# EAGLE design BMSMaster (EAGLE 6.6.0)

## Sheet 1 of 2
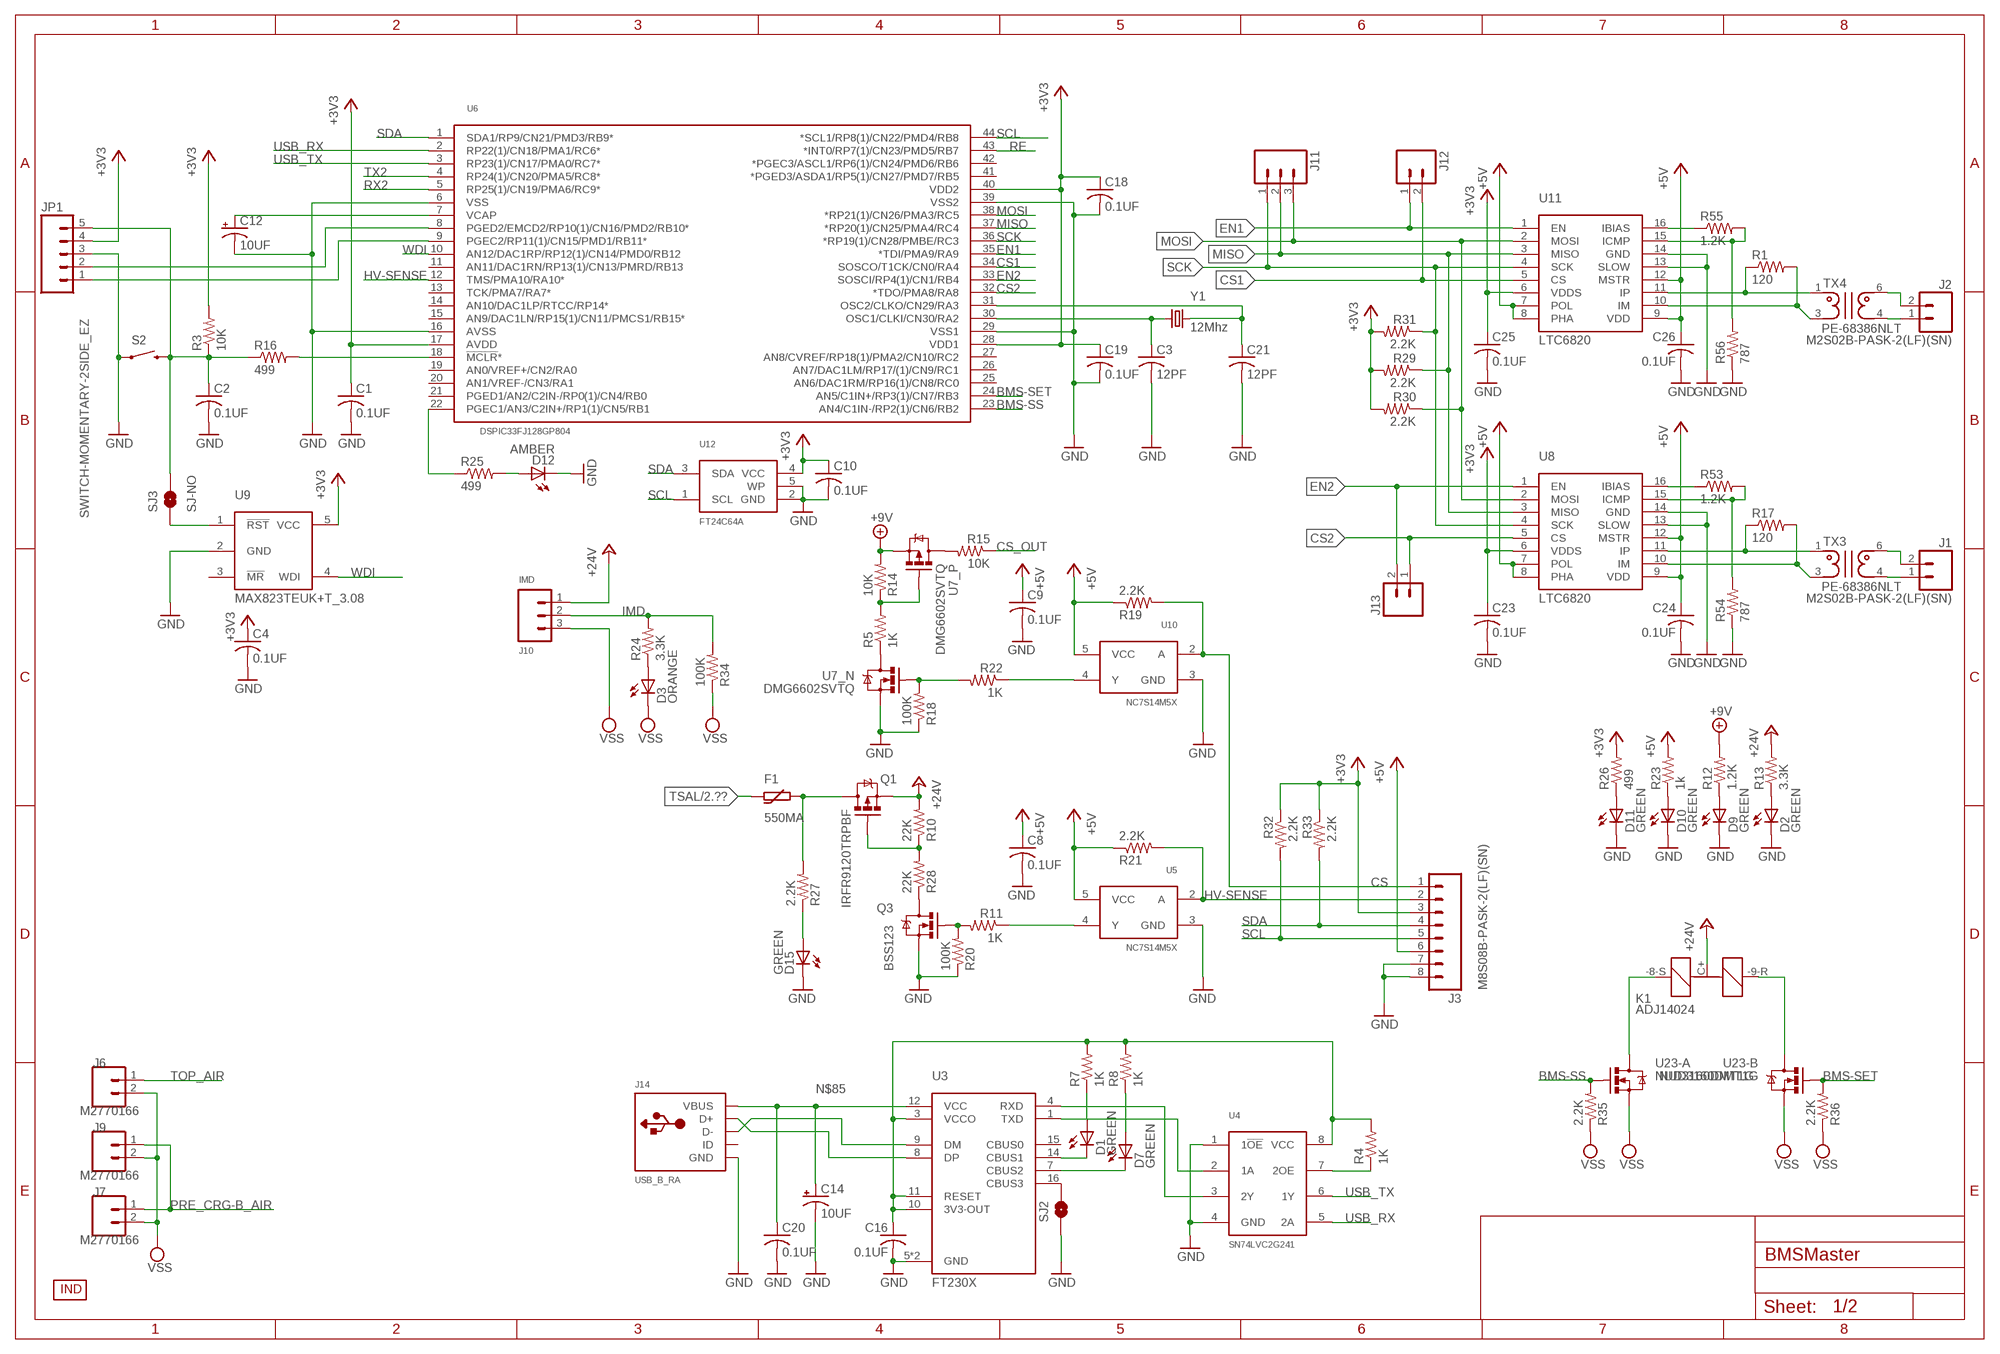
[diagram p0: schematic, sheet 1]

### Parts
C1  0.1UF  CAP_0.1UF_50V_0805  [0805]
C2  0.1UF  CAP_0.1UF_50V_0805  [0805]
C3  12PF  CAP_12PF_50V_0805  [0805]
C4  0.1UF  CAP_0.1UF_50V_0805  [0805]
C8  0.1UF  CAP_0.1UF_50V_0805  [0805]
C9  0.1UF  CAP_0.1UF_50V_0805  [0805]
C10  0.1UF  CAP_0.1UF_50V_0805  [0805]
C12  10UF  CAP-POL_10UF_16V  [EIA3216-16V]
C14  10UF  CAP-POL_10UF_16V  [EIA3216-16V]
C16  0.1UF  CAP_0.1UF_50V_0805  [0805]
C18  0.1UF  CAP_0.1UF_50V_0805  [0805]
C19  0.1UF  CAP_0.1UF_50V_0805  [0805]
C20  0.1UF  CAP_0.1UF_50V_0805  [0805]
C21  12PF  CAP_12PF_50V_0805  [0805]
C23  0.1UF  CAP_0.1UF_50V_0805  [0805]
C24  0.1UF  CAP_0.1UF_50V_0805  [0805]
C25  0.1UF  CAP_0.1UF_50V_0805  [0805]
C26  0.1UF  CAP_0.1UF_50V_0805  [0805]
D1  GREEN  LED_GREEN  [CHIP_LED0805]
D2  GREEN  LED_GREEN  [CHIP_LED0805]
D3  ORANGE  LED_ORANGE  [CHIP_LED0805]
D7  GREEN  LED_GREEN  [CHIP_LED0805]
D9  GREEN  LED_GREEN  [CHIP_LED0805]
D10  GREEN  LED_GREEN  [CHIP_LED0805]
D11  GREEN  LED_GREEN  [CHIP_LED0805]
D12  AMBER  LED_AMBER  [CHIP_LED0805]
D15  GREEN  LED_GREEN  [CHIP_LED0805]
F1  550MA  PTC_550MA_60V  [2018]
J1  M2S02B-PASK-2(LF)(SN)  [S02B-PASK-2(LF)(SN)]
J2  M2S02B-PASK-2(LF)(SN)  [S02B-PASK-2(LF)(SN)]
J3  M8S08B-PASK-2(LF)(SN)  [S08B-PASK-2(LF)(SN)]
J6  M2770166  [1-770166-0]
J7  M2770166  [1-770166-0]
J9  M2770166  [1-770166-0]
J10  IMD  M3M1X3  [MOLEX-1X3]
J11  M03LOCK_LONGPADS  [1X03_LOCK_LONGPADS]
J12  M02LOCK_LONGPADS  [1X02_LOCK_LONGPADS]
J13  M02LOCK_LONGPADS  [1X02_LOCK_LONGPADS]
J14  USB_B_RA  [USB-B1HSW6]
JP1  M05LOCK_LONGPADS  [1X05_LOCK_LONGPADS]
K1  ADJ14024  [ADJ14024]
Q1  IRFR9120TRPBF  MOS-P_IRFR9120TRPBF  [DPAK]
Q3  BSS123  MOS-N_BSS123  [SOT23]
R1  120  RES_120_1%_0805  [0805]
R3  10K  RES_10K_1%_0805  [0805]
R4  1K  RES_1K_1%_0805  [0805]
R5  1K  RES_1K_1%_0805  [0805]
R7  1K  RES_1K_1%_0805  [0805]
R8  1K  RES_1K_1%_0805  [0805]
R10  22K  RES_22K_1%_0805  [0805]
R11  1K  RES_1K_1%_0805  [0805]
R12  1.2K  RES_1.2K_1%_0805  [0805]
R13  3.3K  RES_3.3K_1%_0805  [0805]
R14  10K  RES_10K_1%_0805  [0805]
R15  10K  RES_10K_1%_0805  [0805]
R16  499  RES_499_1%_0805  [0805]
R17  120  RES_120_1%_0805  [0805]
R18  100K  RES_100K_1%_0805  [0805]
R19  2.2K  RES_2.2K_1%_0805  [0805]
R20  100K  RES_100K_1%_0805  [0805]
R21  2.2K  RES_2.2K_1%_0805  [0805]
R22  1K  RES_1K_1%_0805  [0805]
R23  1k  RES_1K_1%_0805  [0805]
R24  3.3K  RES_3.3K_1%_0805  [0805]
R25  499  RES_499_1%_0805  [0805]
R26  499  RES_499_1%_0805  [0805]
R27  2.2K  RES_2.2K_1%_0805  [0805]
R28  22K  RES_22K_1%_0805  [0805]
R29  2.2K  RES_2.2K_1%_0805  [0805]
R30  2.2K  RES_2.2K_1%_0805  [0805]
R31  2.2K  RES_2.2K_1%_0805  [0805]
R32  2.2K  RES_2.2K_1%_0805  [0805]
R33  2.2K  RES_2.2K_1%_0805  [0805]
R34  100K  RES_100K_1%_0805  [0805]
R35  2.2K  RES_2.2K_1%_0805  [0805]
R36  2.2K  RES_2.2K_1%_0805  [0805]
R53  1.2K  RES_1.2K_1%_0805  [0805]
R54  787  RES_787_1%  [0805]
R55  1.2K  RES_1.2K_1%_0805  [0805]
R56  787  RES_787_1%  [0805]
S2  SWITCH-MOMENTARY-2SIDE_EZ  [TACTILE-PTH-SIDEEZ]
SJ2  JUMPER-PAD-2-NOYES_SILK  [PAD-JUMPER-2-NO_YES_SILK]
SJ3  SJ-NO  SOLDERJUMPERNO  [SJ_2S-NO]
TX3  PE-68386NLT  [PE-68386NLT]
TX4  PE-68386NLT  [PE-68386NLT]
U3  FT230X  [SSOP-16]
U4  SN74LVC2G241  [VFSOP-8]
U5  NC7S14M5X  [SOT23-5]
U6  DSPIC33FJ128GP804  [TQFP-44]
U7  DMG6602SVTQ  [SOT23-6]
U8  LTC6820  [MSOP-16]
U9  MAX823TEUK+T_3.08  [SOT23-5]
U10  NC7S14M5X  [SOT23-5]
U11  LTC6820  [MSOP-16]
U12  FT24C64A  [SOT23-5]
U23  NUD3160DMT1G  [SC74-6]
U$1  INDPK1  [PICKIT-PIN-1]
Y1  12Mhz  CRYSTAL5X3  [CRYSTAL-SMD-5X3]

### Nets
3V: C16.1(+) R4.2 R7.2 R8.2 U3.3(VCCO) U3.10(3V3-OUT) U3.11(RESET) U4.8(VCC)
+3V3: C1.1(+) C4.1(+) C10.1(+) C18.1(+) C19.1(+) C23.1(+) C25.1(+) J3.3 JP1.4 R3.2 R26.2 R29.2 R30.2 R31.2 R32.1 R33.1 U6.17(AVDD) U6.28(VDD1) U6.40(VDD2) U8.6(VDDS) U9.5(VCC) U11.6(VDDS) U12.4(VCC) ; also sheet 2
+5V: C8.1(+) C9.1(+) C24.1(+) C26.1(+) J3.6 R19.1 R21.1 R23.2 U5.5(VCC) U8.7(POL) U8.8(PHA) U8.9(VDD) U8.12(MSTR) U10.5(VCC) U11.7(POL) U11.8(PHA) U11.9(VDD) U11.12(MSTR) ; also sheet 2
+9V: R12.2 R14.2 U7.2(_P:S) ; also sheet 2
+24V: J10.1 K1.C+(-) Q1.3(S) R10.2 R13.2 ; also sheet 2
BMS-SET: R36.2 U6.24(AN5/C1IN+/RP3(1)/CN7/RB3) U23.5(-B:G)
BMS-SS: R35.2 U6.23(AN4/C1IN-/RP2(1)/CN6/RB2) U23.2(-A:G)
CS: J3.1 R19.2 U10.2(A)
CS1: J12.2 U6.34(SOSCO/T1CK/CN0/RA4) U11.5(CS)
CS2: J13.1 U6.32(*TDO/PMA8/RA8) U8.5(CS)
CS_OUT: R15.1 ; also sheet 2
EN1: J12.1 U6.35(*TDI/PMA9/RA9) U11.1(EN)
EN2: J13.2 U6.33(SOSCI/RP4(1)/CN1/RB4) U8.1(EN)
GND: C1.2(-) C2.2(-) C3.2(-) C4.2(-) C8.2(-) C9.2(-) C10.2(-) C12.C(-) C14.C(-) C16.2(-) C18.2(-) C19.2(-) C20.2(-) C21.2(-) C23.2(-) C24.2(-) C25.2(-) C26.2(-) D2.C D9.C D10.C D11.C D12.C D15.C J3.7 J3.8 J14.4(GND) JP1.3 Q3.2(S) R18.1 R20.1 R54.1 R56.1 S2.1 SJ2.1 U3.5(GND) U3.13(GND) U4.1(1!OE) U4.4(GND) U5.3(GND) U6.6(VSS) U6.16(AVSS) U6.29(VSS1) U6.39(VSS2) U7.5(_N:S) U8.13(SLOW) U8.14(GND) U9.2(GND) U10.3(GND) U11.13(SLOW) U11.14(GND) U12.2(GND) U12.5(WP) ; also sheet 2
HV-SENSE: J3.2 R21.2 U5.2(A) U6.12(TMS/PMA10/RA10*)
IMD: J10.2 R24.2 R34.2 ; also sheet 2
MISO: J11.2 R29.1 U6.37(*RP20(1)/CN25/PMA4/RC4) U8.3(MISO) U11.3(MISO)
MOSI: J11.3 R30.1 U6.38(*RP21(1)/CN26/PMA3/RC5) U8.2(MOSI) U11.2(MOSI)
N$1: D12.A R25.2
N$2: C21.1(+) U6.31(OSC2/CLKO/CN29/RA3) Y1.3
N$4: C3.1(+) U6.30(OSC1/CLKI/CN30/RA2) Y1.1
N$5: SJ3.1 U9.1(!RST)
N$6: D7.A R8.1
N$7: D9.A R12.1
N$8: D7.C U3.7(CBUS2)
N$9: D10.A R23.1
N$10: D1.C U3.14(CBUS1)
N$11: Q1.1(G) R10.1 R28.2
N$12: D15.A R27.1
N$13: D11.A R26.1
N$14: U3.4(RXD) U4.3(2Y)
N$15: U3.1(TXD) U4.2(1A)
N$16: J14.2(D-) U3.9(DM)
N$17: K1.-8-S(+1) U23.6(-A:D)
N$18: J14.3(D+) U3.8(DP)
N$19: R11.1 U5.4(Y)
N$20: D1.A R7.1
N$25: R53.1 U8.16(IBIAS)
N$26: R53.2 R54.2 U8.15(ICMP)
N$27: C12.A(+) U6.7(VCAP)
N$28: R55.1 U11.16(IBIAS)
N$29: R55.2 R56.2 U11.15(ICMP)
N$30: D2.A R13.1
N$33: J1.2 TX3.6
N$34: J1.1 TX3.4
N$35: R17.1 TX3.1 U8.11(IP)
N$36: R17.2 TX3.3 U8.10(IM)
N$37: R1.1 TX4.1 U11.11(IP)
N$38: R1.2 TX4.3 U11.10(IM)
N$39: R5.2 R14.1 U7.3(_P:G)
N$40: R5.1 U7.6(_N:D)
N$41: R22.1 U10.4(Y)
N$42: D3.A R24.1
N$43: SJ2.2 U3.16(CBUS3)
N$44: R25.1 U6.22(PGEC1/AN3/C2IN+/RP1(1)/CN5/RB1)
N$45: C2.1(+) JP1.5 R3.1 R16.1 S2.2 SJ3.2
N$46: R16.2 U6.18(!MCLR!*)
N$47: JP1.2 U6.8(PGED2/EMCD2/RP10(1)/CN16/PMD2/RB10*)
N$48: JP1.1 U6.9(PGEC2/RP11(1)/CN15/PMD1/RB11*)
N$49: R15.2 U7.4(_P:D)
N$50: Q3.3(D) R28.1
N$51: F1.2 Q1.2(D) R27.2
N$53: J2.2 TX4.6
N$54: K1.-9-R(+2) U23.3(-B:D)
N$55: J2.1 TX4.4
N$69: R4.1 U4.7(2OE)
N$85: C14.A(+) C20.1(+) J14.1(VBUS) U3.12(VCC)
PRE_CRG-B_AIR: J7.1 J9.1 ; also sheet 2
RE: U6.43(*INT0/RP7(1)/CN23/PMD5/RB7) ; also sheet 2
RX2: U6.5(RP25(1)/CN19/PMA6/RC9*) ; also sheet 2
SCK: J11.1 R31.1 U6.36(*RP19(1)/CN28/PMBE/RC3) U8.4(SCK) U11.4(SCK)
SCL: J3.5 R32.2 U6.44(*SCL1/RP8(1)/CN22/PMD4/RB8) U12.1(SCL)
SDA: J3.4 R33.2 U6.1(SDA1/RP9/CN21/PMD3/RB9*) U12.3(SDA)
TOP_AIR: J6.1 ; also sheet 2
TSAL: F1.1 ; also sheet 2
TSAL_EN: Q3.1(G) R11.2 R20.2
TSAL_EN1: R18.2 R22.2 U7.1(_N:G)
TX2: U6.4(RP24(1)/CN20/PMA5/RC8*) ; also sheet 2
USB_RX: U4.5(2A) U6.2(RP22(1)/CN18/PMA1/RC6*)
USB_TX: U4.6(1Y) U6.3(RP23(1)/CN17/PMA0/RC7*)
VSS: D3.C J6.2 J7.2 J9.2 J10.3 R34.1 R35.1 R36.1 U23.1(-A:S) U23.4(-B:S) ; also sheet 2
WDI: U6.10(AN12/DAC1RP/RP12(1)/CN14/PMD0/RB12) U9.4(WDI)
Unconnected: J14.S1(ID) K1.C K1.NC K1.NO U3.15(CBUS0) U6.11(AN11/DAC1RN/RP13(1)/CN13/PMRD/RB13) U6.13(TCK/PMA7/RA7*) U6.14(AN10/DAC1LP/RTCC/RP14*) U6.15(AN9/DAC1LN/RP15(1)/CN11/PMCS1/RB15*) U6.19(AN0/VREF+/CN2/RA0) U6.20(AN1/VREF-/CN3/RA1) U6.21(PGED1/AN2/C2IN-/RP0(1)/CN4/RB0) U6.25(AN6/DAC1RM/RP16(1)/CN8/RC0) U6.26(AN7/DAC1LM/RP17/(1)/CN9/RC1) U6.27(AN8/CVREF/RP18(1)/PMA2/CN10/RC2) U6.41(*PGED3/ASDA1/RP5(1)/CN27/PMD7/RB5) U6.42(*PGEC3/ASCL1/RP6(1)/CN24/PMD6/RB6) U9.3(!MR)

## Sheet 2 of 2
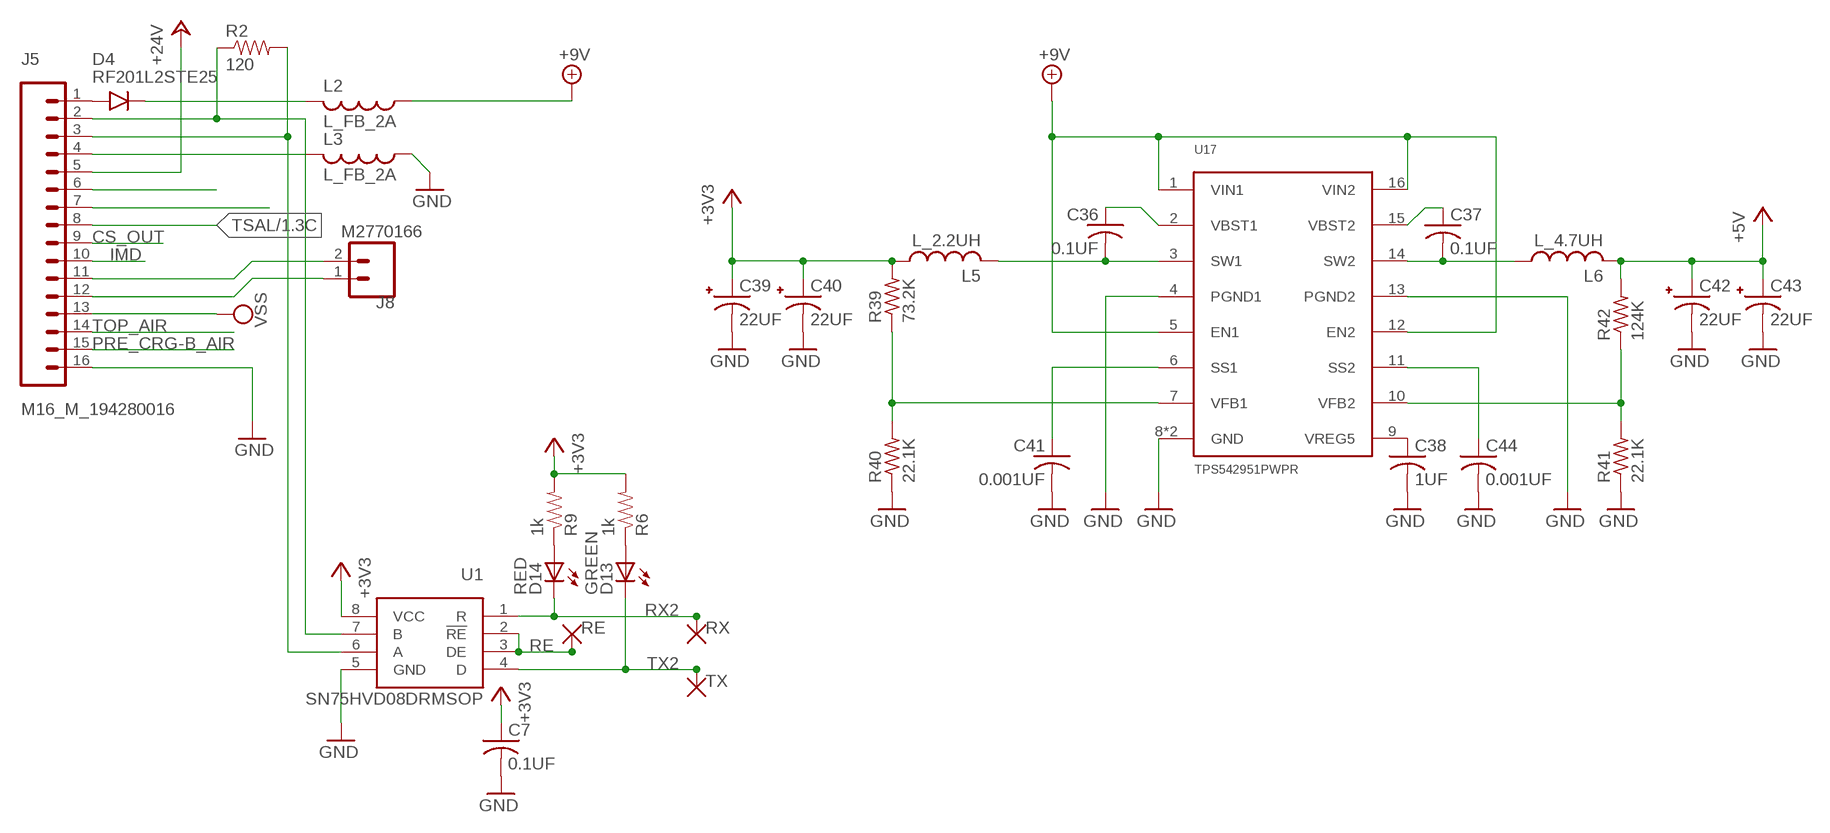
[diagram p1: schematic, sheet 2]

### Parts
C7  0.1UF  CAP_0.1UF_50V_0805  [0805]
C36  0.1UF  C_0.1UF_50V  [R0603]
C37  0.1UF  C_0.1UF_50V  [R0603]
C38  1UF  C_1UF_16V  [R0603]
C39  22UF  C-POL_22UF_35V  [EIA7343]
C40  22UF  C-POL_22UF_35V  [EIA7343]
C41  0.001UF  C_0.001UF_50V  [R0603]
C42  22UF  C-POL_22UF_35V  [EIA7343]
C43  22UF  C-POL_22UF_35V  [EIA7343]
C44  0.001UF  C_0.001UF_50V  [R0603]
D4  RF201L2STE25  DIODE_RF201L2STE25  [SMA]
D13  GREEN  LED_GREEN  [CHIP_LED0805]
D14  RED  LED_RED  [CHIP_LED0805]
J5  M16_M_194280016  [19428-0016]
J8  M2770166  [1-770166-0]
L2  L_FB_2A  [0805]
L3  L_FB_2A  [0805]
L5  L_2.2UH  [LQH43]
L6  L_4.7UH  [LQH43]
R2  120  RES_120_1%_0805  [0805]
R6  1k  RES_1K_1%_0805  [0805]
R9  1k  RES_1K_1%_0805  [0805]
R39  73.2K  R_73.2K_1%  [R0805]
R40  22.1K  R_22.1K_1%  [R0805]
R41  22.1K  R_22.1K_1%  [R0805]
R42  124K  R_124K_1%  [R0805]
RE  TP  [0603]
RX  TP  [0603]
TX  TP  [0603]
U1  SN75HVD08DRMSOP  [MSOP-8]
U17  TPS542951PWPR  [TSSOP-16]

### Nets
+3V3: C7.1(+) C39.+ C40.+ L5.1 R6.2 R9.2 R39.2 U1.8(VCC) ; also sheet 1
+5V: C42.+ C43.+ L6.2 R42.2 ; also sheet 1
+9V: L2.1 U17.1(VIN1) U17.5(EN1) U17.12(EN2) U17.16(VIN2) ; also sheet 1
+24V: J5.5 ; also sheet 1
CS_OUT: J5.9 ; also sheet 1
GND: C7.2(-) C38.2 C39.- C40.- C41.2 C42.- C43.- C44.2 J5.16 L3.1 R40.1 R41.1 U1.5(GND) U17.4(PGND1) U17.8(GND) U17.13(PGND2) U17.EP(GND) ; also sheet 1
IMD: J5.10 ; also sheet 1
INTERLOCK_IN: J5.11 J8.2
INTERLOCK_OUT: J5.12 J8.1
N$3: D13.A R6.1
N$21: J5.6
N$22: D14.A R9.1
N$23: J5.2 R2.1 U1.7(B)
N$24: J5.3 R2.2 U1.6(A)
N$52: J5.7
N$77: C44.1 U17.11(SS2)
N$88: J5.4 L3.2
N$89: D4.A J5.1
N$91: D4.C L2.2
N$94: C36.1 U17.2(VBST1)
N$97: C36.2 L5.2 U17.3(SW1)
N$98: C37.1 U17.15(VBST2)
N$99: C37.2 L6.1 U17.14(SW2)
N$100: C38.1 U17.9(VREG5)
N$101: R39.1 R40.2 U17.7(VFB1)
N$102: C41.1 U17.6(SS1)
N$103: R41.2 R42.1 U17.10(VFB2)
PRE_CRG-B_AIR: J5.15 ; also sheet 1
RE: RE.1 RE.2 U1.2(!RE) U1.3(DE) ; also sheet 1
RX2: D14.C RX.1 RX.2 U1.1(R) ; also sheet 1
TOP_AIR: J5.14 ; also sheet 1
TSAL: J5.8 ; also sheet 1
TX2: D13.C TX.1 TX.2 U1.4(D) ; also sheet 1
VSS: J5.13 ; also sheet 1

## Library data of the parts
C1 C2 C4 C7-C10 C16 C18-C20 C23-C26 = FSAE Electric:CAP; PARTNO: CC0805ZRY5V9BB104
C3 C21 = FSAE Electric:CAP; PARTNO: CL21C120JBANNNC
C12 C14 = FSAE Electric:CAP-POL; PARTNO: T491A106M016AT
C36 C37 = DFT2:C; PARTNO: CC0603ZRY5V9BB104
C38 = DFT2:C; PARTNO: CL10B105MO8NNWC
C39 C40 C42 C43 = DFT2:C-POL; PARTNO: T495D226K035ATE300
C41 C44 = DFT2:C; PARTNO: GRM188R71H103KA01D
D1 D2 D7 D9-D11 D13 D15 = FSAE Electric:LED; PARTNO: LTST-S220GKT
D3 = FSAE Electric:LED; PARTNO: LTST-C170KFKT
D4 = FSAE Electric:DIODE: Diodes; PARTNO: RF201L2STE25
D12 = FSAE Electric:LED; PARTNO: HSMA-C170
D14 = FSAE Electric:LED; PARTNO: LH R974-LP-1
F1 = FSAE Electric:PTC; PARTNO: MF-SMDF050-2
J1 J2 = FSAE Electric:M2; PARTNO: S02B-PASK-2(LF)(SN)
J3 = FSAE Electric:M8: Molex 8-pin Connectors; PARTNO: S08B-PASK-2(LF)(SN)
J5 = FSAE Electric:M16; PARTNO: 0194280016
J6-J9 = FSAE Electric:M2; PARTNO: 1-770166-0
J10 = FSAE Electric:M3: Molex 3-Pin Connectors; PARTNO: 0022232031
J11 = SparkFun-Connectors:M03: Header 3 Standard 3-pin 0.1" header. Use with straight break away headers (SKU : PRT-00116), right angle break away headers (PRT-00553), swiss pins (PRT-00743), machine pins (PRT-00117), and female headers (PRT-00115). Molex polarized connector foot print use with SKU : PRT-08232 with associated crimp pins and housings.
J12 J13 = SparkFun-Connectors:M02: Standard 2-pin 0.1" header. Use with - straight break away headers ( PRT-00116) - right angle break away headers (PRT-00553) - swiss pins (PRT-00743) - machine pins (PRT-00117) - female headers (PRT-00115) Molex polarized connector foot print use with: PRT-08233 with associated crimp pins and housings. 2.54_SCREWTERM for use with PRT-10571. 3.5mm Screw Terminal footprints for PRT-08084 5mm Screw Terminal footprints for use with PRT-08432
J14 = FSAE Electric:USB; PARTNO: USB-B1HSW6
JP1 = SparkFun-Connectors:M05: Header 5 Standard 5-pin 0.1" header. Use with straight break away headers (SKU : PRT-00116), right angle break away headers (PRT-00553), swiss pins (PRT-00743), machine pins (PRT-00117), and female headers (PRT-00115). Molex polarized connector foot print use with SKU : PRT-08230 with associated crimp pins and housings.
K1 = FSAE Electric:ADJ14024; PARTNO: ADJ14024
L2 L3 = FSAE Electric:L; PARTNO: FBMH2012HM121-T
L5 = DFT2:L; PARTNO: LQH43PN2R2M26L
L6 = DFT2:L; PARTNO: LQH43PN4R7M26L
Q1 = FSAE Electric:MOS-P: P-Channel Mosfets; PARTNO: IRFR9120TRPBF
Q3 = FSAE Electric:MOS-N: N-Channel Mosfets; PARTNO: BSS123,215
R1 R2 R17 = FSAE Electric:RES: Resistors; PARTNO: RC0805FR-07120RL
R3 R14 R15 = FSAE Electric:RES: Resistors; PARTNO: RC0805FR-0710KL
R4-R9 R11 R22 R23 = FSAE Electric:RES: Resistors; PARTNO: RC0805FR-071KL
R10 R28 = FSAE Electric:RES: Resistors; PARTNO: RC0805FR-0722KL
R12 R53 R55 = FSAE Electric:RES: Resistors; PARTNO: RC0805FR-071K2L
R13 R24 = FSAE Electric:RES: Resistors; PARTNO: RC0805FR-073K3L
R16 R25 R26 = FSAE Electric:RES: Resistors; PARTNO: RC0805FR-07499RL
R18 R20 R34 = FSAE Electric:RES: Resistors; PARTNO: RC0805FR-07100KL
R19 R21 R27 R29-R33 R35 R36 = FSAE Electric:RES: Resistors; PARTNO: RC0805FR-072K2L
R39 = DFT2:R; PARTNO: RC0805FR-0773K2L
R40 R41 = DFT2:R; PARTNO: RC0805FR-0722K1L
R42 = DFT2:R; PARTNO: RC0805FR-07124KL
R54 R56 = FSAE Electric:RES: Resistors; PARTNO: RC0805FR-07787RL
RE RX TX = FSAE Electric:TP: SMD test points to make life easy to test / debug; PARTNO: 1625854-3
S2 = SparkFun-Electromechanical:SWITCH-MOMENTARY-2: Various NO switches- pushbuttons, reed, etc; PARTNO: 3-1825910-5
SJ2 = SparkFun-Passives:JUMPER-PAD-2-NO
SJ3 = SparkFun-Passives:SOLDERJUMPER: Solder Jumper Standard SMD solder jumper. Used to automate production. Two varients : Normally Open and Normally Closed are the same, but have different paste layers. NC will have a large amount of paste and should jumper during reflow.
TX3 TX4 = FSAE Electric:PE-68386NLT; PARTNO: PE-68386NLT
U1 = FSAE Electric:SN75HVD08DR: RS485 Transceiver View on DigiKey <http://www.digikey.com/product-detail/en/SN75HVD08DR/296-37893-1-ND/4899996>; PARTNO: ISL83072EIUZA-T
U3 = FSAE Electric:FT230X; PARTNO: FT230XS-R
U4 = FSAE Electric:SN74LVC2G241; PARTNO: SN74LVC2G241DCUR
U5 U10 = FSAE Electric:NC7S14M5X; PARTNO: NC7S14M5X
U6 = FSAE Electric:DSPIC33FJ128GP804; PARTNO: DSPIC33FJ128GP804-I/PT
U7 = FSAE Electric:DMG6602SVTQ: DMG6602SVTQ-7 MOSFET N/P-CH 30V; PARTNO: DMG6602SVTQ-7
U8 U11 = FSAE Electric:LTC6820: isoSPI Isolated Communications Interface; PARTNO: LTC6820IMS#PBF
U9 = FSAE Electric:MAX823: IC SUPERV MPU CIRC SOT-23-5; PARTNO: MAX823TEUK+T
U12 = FSAE Electric:FT24C64A: IC EEPROM 64KBIT 1MHZ SOT23-5; PARTNO: FT24C64A-ULR-T
U17 = DFT2:TPS542951PWPR
U23 = FSAE Electric:NUD3160DMT1G; PARTNO: NUD3160DMT1G
U$1 = FSAE Eletric (2):IND
Y1 = SparkFun-FreqCtrl:CRYSTAL: Various standard crystals. Proven footprints. Spark Fun Electronics SKU : COM-00534

## Net classes
0 default: clearance 0.18 mm

## Board
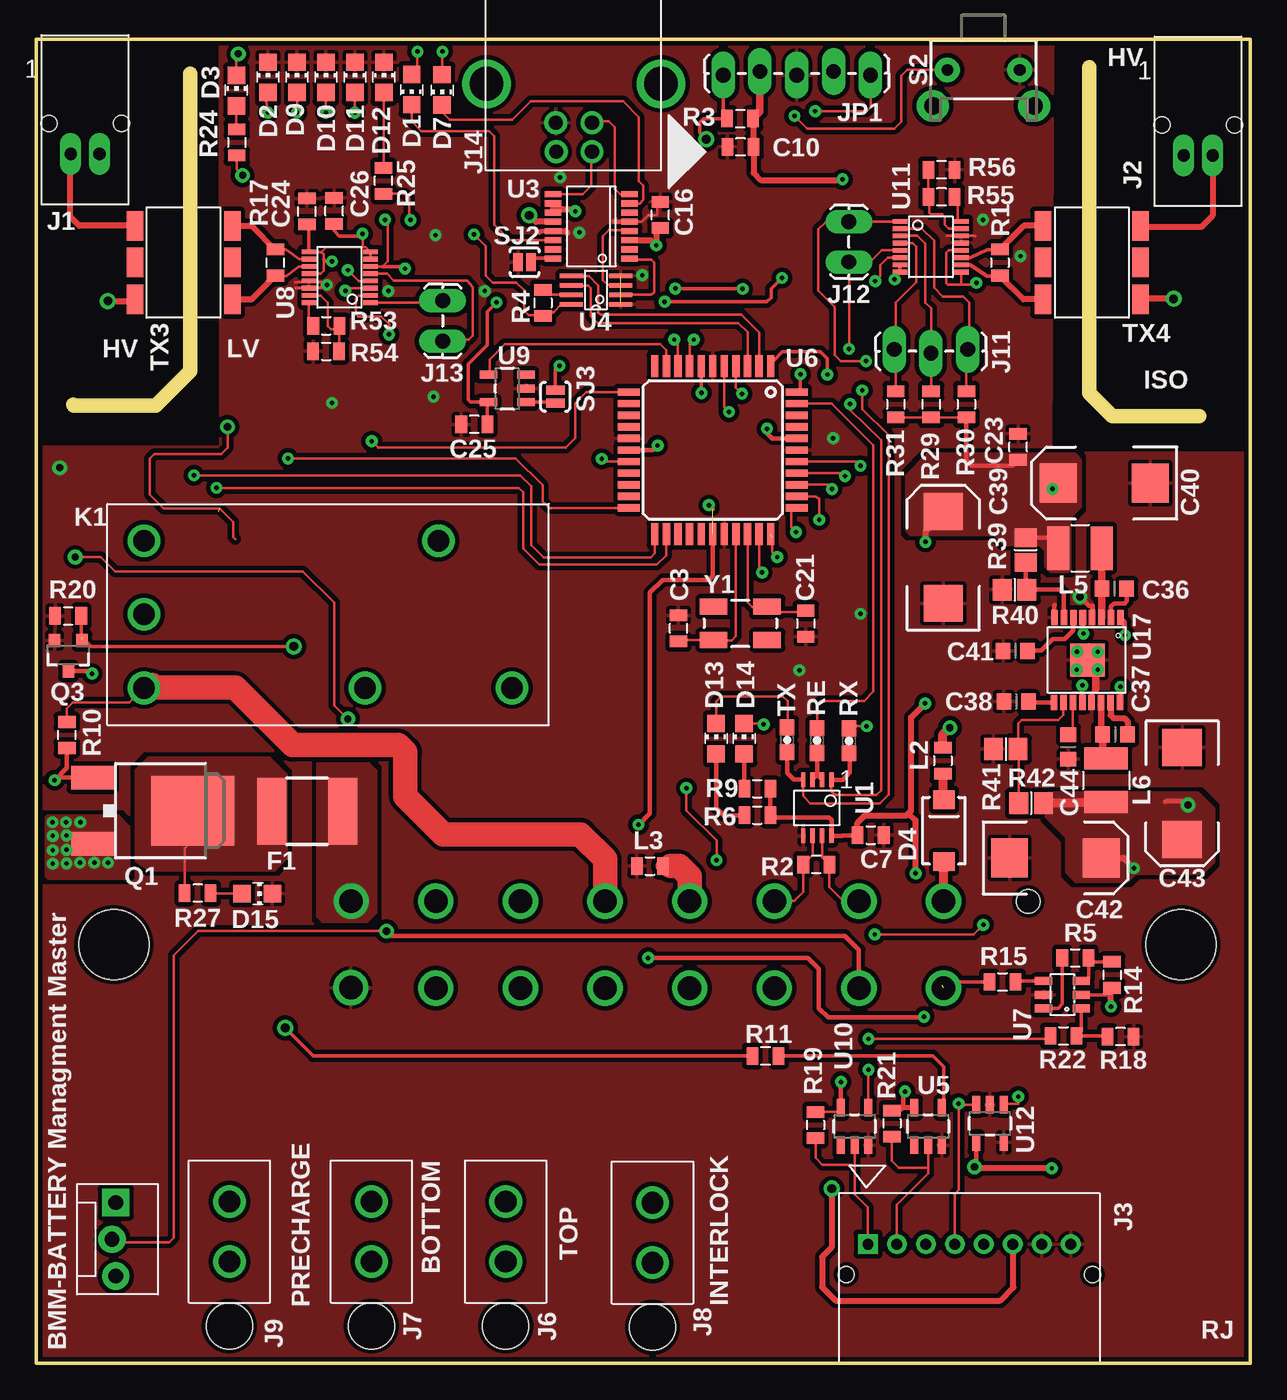
[diagram p2: board, top side]
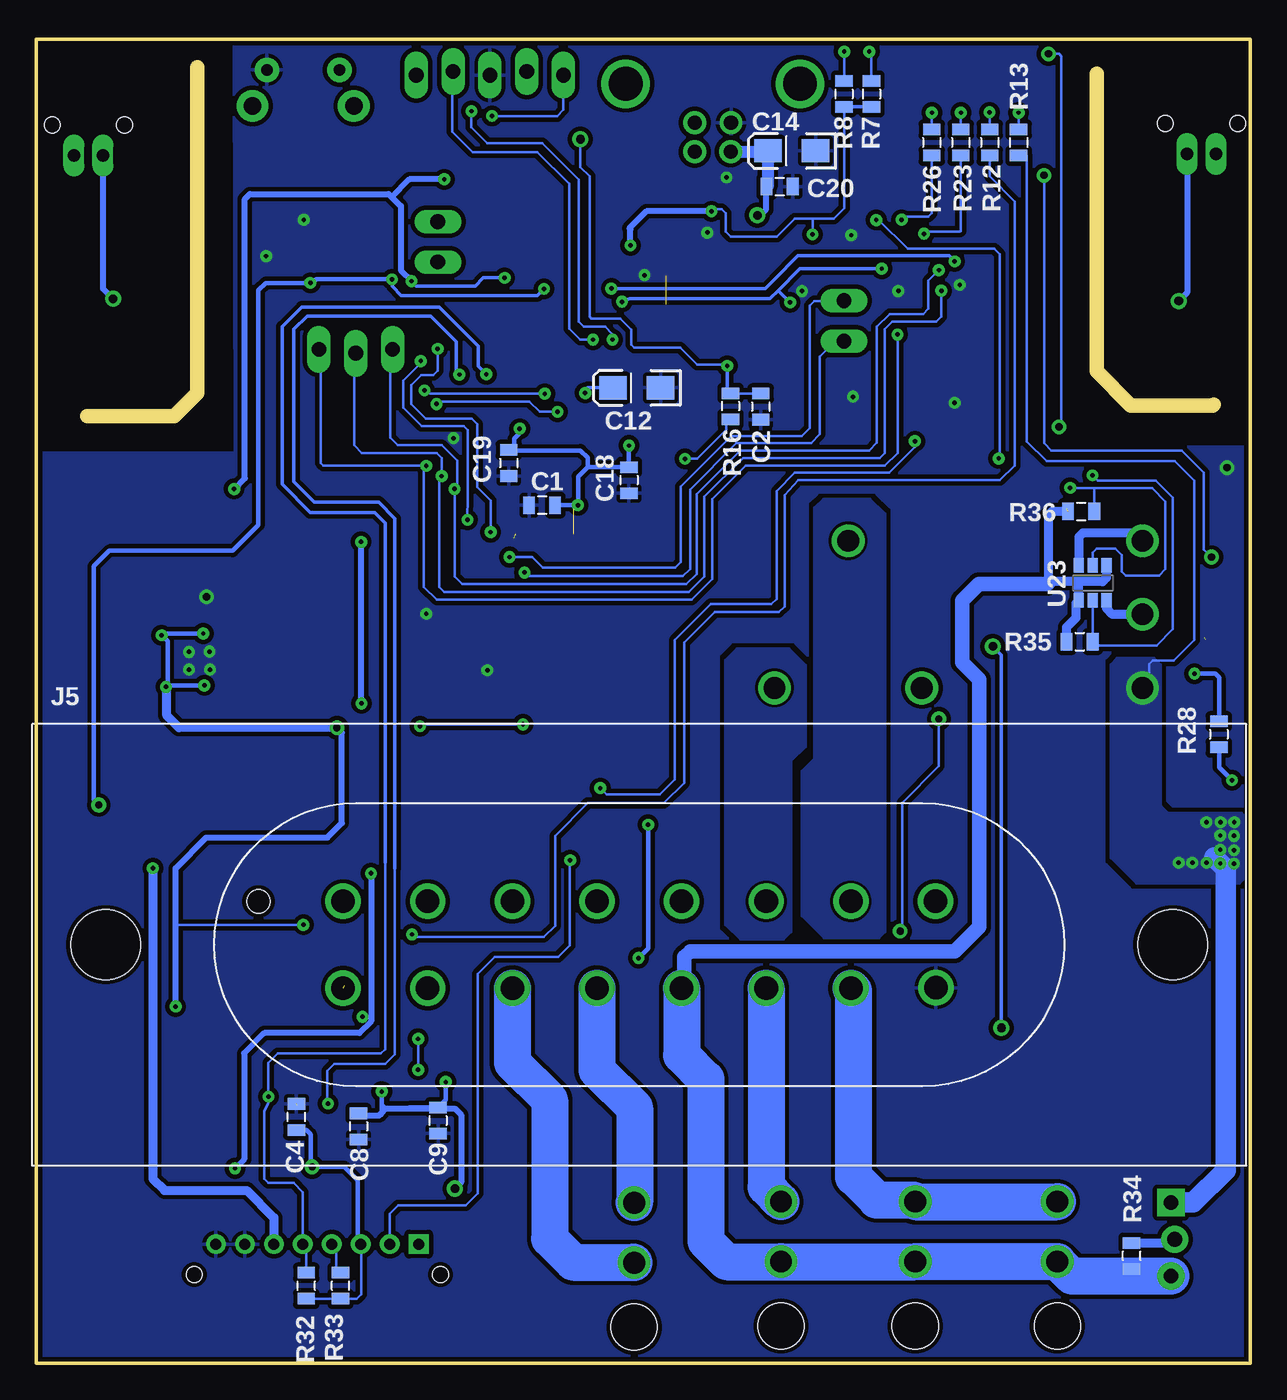
[diagram p3: board, bottom side, seen from below]

Size 83.82 x 91.44 mm. Coordinates in mm from the lower left corner, seen from the top.
Outline: 10.62,89.05 10.62,68.5 8.26,66.14 2.59,66.14 2.54,66.19
Outline: 72.69,89.51 72.69,67 74.3,65.4 80.29,65.4
Outline: 0,0 0,91.44 83.82,91.44 83.82,0 0,0
Copper layers (1*16): Top 0.035mm / dielectric 1.5mm / Bottom 0.035mm
Design rules "SparkFun *": minimum track width 7mil, minimum drill 12mil, track to track 8mil, track to pad 8mil, pad to pad 8mil, via to via 8mil, smd to smd 8mil, copper to edge 10mil, drill to drill 8mil, minimum pad ring 12mil, minimum via ring 10mil, stop-mask expansion 4mil, vias tented up to drill 25mil, thermal gap 10mil

### Footprints (pad centres in the part's own frame; a part is rotated, then mirrored left to right if it is on the bottom)
0805 = smd 0.8 x 1.2: 1 -0.9,0; 2 0.9,0
EIA3216-16V = smd 1.9 x 1.6: A 1.65,0; C -1.65,0
R0603 = smd 1 x 1.1: 1 -0.85,0; 2 0.85,0
EIA7343 = smd 2.7 x 2.55: + 0,3.17; - 0,-3.17
CHIP_LED0805 = smd 1.2 x 1.2: A 0,-1.05; C 0,1.05
SMA = smd 1.27 x 1.47: A -2.15,0; C 2.15,0
2018 = smd 2 x 4.6: 1 -2.45,0; 2 2.45,0
S02B-PASK-2(LF)(SN) = drill 0.85 long: 1 -1,0; 2 1,0 | hole 1.1: -2.5,2.1; 2.5,2.1
S08B-PASK-2(LF)(SN) = drill 0.75 square: 1 7,0 | drill 0.75: 2 5,0; 3 3,0; 4 1,0; 5 -1,0; 6 -3,0; 7 -5,0; 8 -7,0 | hole 1.1: -8.5,2.1; 8.5,2.1
19428-0016 = drill 1.626: 1 -20.447,2.997; 2 -14.605,2.997; 3 -8.763,2.997; 4 -2.921,2.997; 5 2.921,2.997; 6 8.763,2.997; 7 14.605,2.997; 8 20.447,2.997; 9 -20.447,-2.997; 10 -14.605,-2.997; 11 -8.763,-2.997; 12 -2.921,-2.997; 13 2.921,-2.997; 14 8.763,-2.997; 15 14.605,-2.997; 16 20.472,-2.972 | hole 1.613: -26.289,2.997 | hole 4.826: -36.83,0; 36.83,0
1-770166-0 = drill 1.5: 1 -2.07,0; 2 2.07,0 | hole 3.18: 6.52,0
MOLEX-1X3 = drill 1.016 pad 1.88 square: 1 -2.54,0.127 | drill 1.016 pad 1.88: 2 0,-0.127; 3 2.54,0.127
1X03_LOCK_LONGPADS = drill 1.016 long: 1 0,0; 2 2.54,-0.254; 3 5.08,0
1X02_LOCK_LONGPADS = drill 1.016 long: 1 -0.127,0; 2 2.667,0
USB-B1HSW6 = drill 0.97: 1 7.24,4.68; 2 4.76,4.7; 3 4.76,2.69; 4 7.27,2.7 | drill 2.33: S1 0,0; S2 12.04,0
1X05_LOCK_LONGPADS = drill 1.016 long: 1 0,0; 2 2.54,-0.254; 3 5.08,0; 4 7.62,-0.254; 5 10.16,0
ADJ14024 = drill 1.5: -8-S 0,5.08; -9-R 0,0; C 25.4,-5.08; C+ 0,-5.08; NC 20.32,5.08; NO 15.24,-5.08
LQH43 = smd 1.5 x 3: 1 -1.5,0; 2 1.5,0
DPAK = smd 1.6 x 3: 1 -2.28,-4.04; 3 2.28,-4.04 | smd 4.826 x 5.715: 2 0,2.858
SOT23 = smd 0.8 x 0.9: 1 -0.95,-1; 2 0.95,-1; 3 0,1.1
R0805 = smd 1.3 x 1.5: 1 -0.85,0; 2 0.85,0
0603 = smd 1.1 x 1: 1 -0.85,0; 2 0.85,0
TACTILE-PTH-SIDEEZ = drill 0.8 pad 1.7: 1 -2.5,0; 2 2.5,0 | drill 1.2 pad 2.2: ANCHOR1 -3.5,2.5; ANCHOR2 3.5,2.5
PAD-JUMPER-2-NO_YES_SILK = smd 0.635 x 1.27: 1 -0.45,0; 2 0.45,0
SJ_2S-NO = smd 0.635 x 1.27: 1 -0.45,0; 2 0.45,0
PE-68386NLT = smd 1.143 x 2.032: 1 -3.378,2.54; 2 -3.378,0; 3 -3.378,-2.54; 4 3.353,-2.54; 5 3.353,0; 6 3.353,2.54
MSOP-8 = smd 0.3 x 1: 1 -0.975,-1.95; 2 -0.325,-1.95; 3 0.325,-1.95; 4 0.975,-1.95; 5 0.975,1.925; 6 0.325,1.925; 7 -0.325,1.925; 8 -0.975,1.925
SSOP-16 = smd 0.419 x 1.143: 1 -2.223,-2.642; 2 -1.587,-2.642; 3 -0.953,-2.642; 4 -0.318,-2.642; 5 0.318,-2.642; 6 0.953,-2.642; 7 1.587,-2.642; 8 2.223,-2.642; 9 2.223,2.642; 10 1.587,2.642; 11 0.953,2.642; 12 0.318,2.642; 13 -0.318,2.642; 14 -0.953,2.642; 15 -1.587,2.642; 16 -2.223,2.642
VFSOP-8 = smd 0.3 x 1.6: 1 -0.98,-1.7; 2 -0.33,-1.7; 3 0.33,-1.7; 4 0.98,-1.7; 5 0.97,1.69; 6 0.325,1.7; 7 -0.33,1.7; 8 -0.98,1.71
SOT23-5 = smd 0.55 x 1.2: 1 -0.95,-1.3; 2 0,-1.3; 3 0.95,-1.3; 4 0.95,1.3; 5 -0.95,1.3
TQFP-44 = smd 1.5 x 0.5: 1 -5.8,4; 2 -5.8,3.2; 3 -5.8,2.4; 4 -5.8,1.6; 5 -5.8,0.8; 6 -5.8,0; 7 -5.8,-0.8; 8 -5.8,-1.6; 9 -5.8,-2.4; 10 -5.8,-3.2; 11 -5.8,-4; 23 5.8,-4; 24 5.8,-3.2; 25 5.8,-2.4; 26 5.8,-1.6; 27 5.8,-0.8; 28 5.8,0; 29 5.8,0.8; 30 5.8,1.6; 31 5.8,2.4; 32 5.8,3.2; 33 5.8,4 | smd 0.5 x 1.5: 12 -4,-5.8; 13 -3.2,-5.8; 14 -2.4,-5.8; 15 -1.6,-5.8; 16 -0.8,-5.8; 17 0,-5.8; 18 0.8,-5.8; 19 1.6,-5.8; 20 2.4,-5.8; 21 3.2,-5.8; 22 4,-5.8; 34 4,5.8; 35 3.2,5.8; 36 2.4,5.8; 37 1.6,5.8; 38 0.8,5.8; 39 0,5.8; 40 -0.8,5.8; 41 -1.6,5.8; 42 -2.4,5.8; 43 -3.2,5.8; 44 -4,5.8
SOT23-6 = smd 0.55 x 1.2: 1 -0.95,-1.3; 2 0,-1.3; 3 0.95,-1.3; 4 0.95,1.3; 5 0,1.3; 6 -0.95,1.3
MSOP-16 = smd 0.33 x 1: 1 -1.75,-2.1; 2 -1.25,-2.1; 3 -0.75,-2.1; 4 -0.25,-2.1; 5 0.25,-2.1; 6 0.75,-2.1; 7 1.25,-2.1; 8 1.75,-2.1; 9 1.75,2.15; 10 1.25,2.15; 11 0.75,2.15; 12 0.25,2.15; 13 -0.25,2.15; 14 -0.75,2.15; 15 -1.25,2.15; 16 -1.75,2.15
TSSOP-16 = smd 0.45 x 1.05: 1 2.275,2.925; 2 1.625,2.925; 3 0.975,2.925; 4 0.325,2.925; 5 -0.325,2.925; 6 -0.975,2.925; 7 -1.625,2.925; 8 -2.275,2.925; 9 -2.305,-2.925; 10 -1.655,-2.925; 11 -1.005,-2.925; 12 -0.355,-2.925; 13 0.295,-2.925; 14 0.945,-2.925; 15 1.595,-2.925; 16 2.245,-2.925 | smd 2.4 x 2.31: EP 0,0
SC74-6 = smd 0.7 x 1: 1 -0.95,-1.2; 2 0,-1.2; 3 0.95,-1.2; 4 0.95,1.2; 5 0,1.2; 6 -0.95,1.2
CRYSTAL-SMD-5X3 = smd 1.9 x 1.1: 1 -1.85,-1.15; 2 1.85,-1.15; 3 1.85,1.15; 4 -1.85,1.15

### Placement (x,y rotation side)
C1  48.9,59.26 180 bottom
C2  33.81,66.07 270 bottom
C3  44.34,50.75 90 top
C4  65.86,17.02 90 bottom
C7  57.61,36.47 0 top
C8  61.57,16.36 270 bottom
C9  56.08,16.76 270 bottom
C10  48.62,84 180 top
C12  42.37,67.36 180 bottom
C14  31.66,83.73 180 bottom
C16  43.08,79.3 90 top
C18  42.9,60.99 270 bottom
C19  51.2,62.17 270 bottom
C20  32.5,81.26 0 bottom
C21  53.12,51.08 270 top
C23  67.78,63.29 90 top
C24  18.68,79.54 90 top
C25  30.24,64.84 180 top
C26  20.57,79.58 90 top
C36  74.42,53.49 180 top
C37  74.47,43.43 180 top
C38  67.64,45.69 180 top
C39  62.61,55.65 0 top
C40  73.74,60.78 90 top
C41  67.59,49.2 180 top
C42  70.36,34.9 270 top
C43  79.1,39.34 180 top
C44  71.25,42.57 270 top
D1  25.92,87.96 180 top
D2  16,88.8 0 top
D3  13.82,87.88 0 top
D4  62.66,36.78 90 top
D7  28.02,87.94 180 top
D9  18,88.8 0 top
D10  20,88.8 0 top
D11  22,88.8 0 top
D12  24,88.8 0 top
D13  46.94,43.13 0 top
D14  48.87,43.13 0 top
D15  15.26,32.44 270 top
F1  18.69,38.13 180 top
J1  3.38,83.52 0 top
J2  80.21,83.41 0 top
J3  64.41,8.23 180 top
J5  42.19,28.91 0 bottom
J6  32.41,9.09 270 top
J7  23.14,9.09 270 top
J8  42.55,9.02 270 top
J9  13.34,9.09 270 top
J10  5.36,8.56 270 top
J11  59.22,70.01 0 top
J12  56.1,78.71 270 top
J13  28.06,70.71 90 top
J14  43.13,88.36 180 top
JP1  57.58,88.95 180 top
K1  7.45,51.71 0 top
L2  62.59,41.61 270 top
L3  42.37,34.34 0 top
L5  72.06,56.29 0 top
L6  73.86,40.26 270 top
Q1  7.95,38.16 270 top
Q3  2.21,48.91 180 top
R1  66.53,76.01 270 top
R2  53.85,34.44 180 top
R3  48.59,85.95 0 top
R4  34.99,73.22 270 top
R5  71.73,27.99 0 top
R6  49.78,37.85 0 top
R7  26.16,87.66 270 bottom
R8  28.05,87.66 270 bottom
R9  49.78,39.67 0 top
R10  2.12,43.39 90 top
R11  50.35,21.22 180 top
R12  18,84.3 270 bottom
R13  16,84.3 270 bottom
R14  74.27,26.82 270 top
R15  66.7,26.34 0 top
R16  35.89,66.09 270 bottom
R17  16.51,76.01 90 top
R18  74.85,22.56 180 top
R19  53.8,16.46 270 top
R20  2.21,51.61 0 top
R21  59.07,16.56 270 top
R22  70.92,22.61 0 top
R23  20,84.3 270 bottom
R24  13.84,84.3 270 top
R25  23.97,81.66 90 top
R26  22,84.3 270 bottom
R27  11.14,32.46 180 top
R28  2.18,43.43 270 bottom
R29  61.77,66.22 270 top
R30  64.21,66.22 270 top
R31  59.33,66.22 270 top
R32  65.18,5.36 90 bottom
R33  62.81,5.36 90 bottom
R34  8.2,7.42 90 bottom
R35  11.79,49.83 0 bottom
R36  11.68,58.83 0 bottom
R39  68.3,56.16 90 top
R40  67.54,53.42 0 top
R41  66.93,42.42 0 top
R42  68.68,38.68 0 top
R53  20.03,71.65 0 top
R54  20.02,69.88 0 top
R55  62.49,80.55 180 top
R56  62.49,82.41 180 top
RE  53.9,43 90 top
RX  56.11,42.98 90 top
S2  65.39,89.32 180 top
SJ2  33.71,76.04 0 top
SJ3  35.84,66.75 90 top
TX  51.84,43.05 90 top
TX3  10.16,76.01 180 top
TX4  72.88,76.01 0 top
U1  53.92,38.35 180 top
U3  38.32,78.51 90 top
U4  38.64,74.11 90 top
U5  61.57,16.36 0 top
U6  46.7,63.07 270 top
U7  70.84,25.45 90 top
U8  20.98,74.99 90 top
U9  32.51,67.31 90 top
U10  56.49,16.36 0 top
U11  61.71,77.1 270 top
U12  65.84,16.56 180 top
U17  72.57,48.56 0 top
U23  10.89,53.9 0 bottom
U$1  46.21,83.67 90 top
Y1  48.6,51.1 0 top

### Tracks (layer width: path | path; a pad name or v marks a point on that pad's centre or on a via)
3V  (via drill 0.3)
  Top 0.178: U3.10 U3.11 | U4.8 36.25,73.13 35.71,72.59 | 35.71,72.59 35.69,72.57 34.9,72.57 R4.2 | 35.71,72.59 35.03,72.59 34.92,72.39 34.01,72.36 33.68,72.64 33.68,74.09 33.12,74.62 31.52,74.62 31.04,75.11 31.04,77.14 v30.23,77.95
  Top 0.406: U3.11 35.68,79.9 35.76,79.98 35.76,79.78 35.69,79.7 37.06,79.7 v37.21,79.55 | U3.3 42.44,77.55 v42.8,77.19 42.79,78.1 C16.1
  Bottom 0.178: R8.2 28.05,79.77 28.78,79.04 30.28,79.04 | 30.28,79.04 31.45,79.04 32.69,77.8 35.89,77.8 36.22,78.13 36.22,79.43 36.5,79.7 37.06,79.7 v37.21,79.55 | v30.23,77.95 30.23,78.99 30.28,79.04
  Bottom 0.254: R8.2 R7.2
  Bottom 0.406: v37.21,79.55 41.7,79.55 42.87,78.38 42.8,78.3 v42.8,77.19
+3V3  (via drill 0.3, 0.5)  (1 unrouted)
  Top 0.178: U11.6 59.59,76.35 58.78,76.35 58.27,75.84 58.27,75.08 v57.91,74.73 | R30.2 R29.2 R31.2 | v24.08,78.97 24.08,78.94 24.28,78.74 24.28,76.12 23.9,75.74 U8.6
  Top 0.254: C25.1 31.14,66.29 U9.5 30.01,66.36 29.82,66.55 29.82,68.99 31.14,70.31 31.14,72.62 v31.77,73.25 | 23.9,75.74 25.3,75.74 v25.45,75.59 | v43.38,73.3 50.44,73.3 50.72,73.58 50.75,74.22 v51.49,74.96 51.26,74.73
  Top 0.305: 46.7,58.99 v46.43,59.26 | U6.17 42.6,63.07 v42.9,63.37 | U6.40 50.81,63.87 50.44,64.24 v50.44,64.54 | R39.2 69.84,57.01 L5.1 | R30.2 64.21,62.36 64.57,62 67.4,62 C23.1 | U12.4 64.89,13.68 v64.77,13.56 | R9.2 R6.2 50.84,37.69 54.71,37.69 54.9,37.51 U1.8 55.66,36.43 55.68,36.45 56.68,36.45 C7.1 | U6.28 46.7,54.35 46.46,54.1 43.26,54.1 42.37,53.21 42.37,37.97 v41.58,37.19 | v42.24,27.99 53.26,27.99 54.03,27.23 54.03,24.51 54.66,23.88 61.24,23.88 v61.29,23.93 | v70.16,60.38 C40.+
  Top 0.406: 56.68,36.45 56.68,37.3 57.2,37.82 60.05,37.82 60.21,37.99 | 60.21,37.99 60.4,38.18 60.4,44.6 v61.37,45.57 | v61.39,56.72 61.39,57.43 61.59,57.63 | v70.1,13.46 64.87,13.46 v64.77,13.56 | v60.71,33.83 60.71,37.49 60.21,37.99 | R3.2 49.49,84.02 C10.1 49.52,82.21 50.01,81.71 55.6,81.71 v55.65,81.76
  Top 0.508: JP1.4 49.96,86.42 R3.2
  Bottom 0.178: R32.1 R33.1 61.68,4.46 61.37,4.77 61.37,8.18 J3.3 | R26.2 22,79.42 22.25,79.17 23.88,79.17 v24.08,78.97
  Bottom 0.254: v25.45,75.59 31.11,75.59 32.6,74.08 | 32.6,74.08 33.17,73.53 42.85,73.53 v43.38,73.3 | v51.49,74.96 52.96,74.96 53.52,74.4 57.58,74.4 v57.91,74.73 | v31.77,73.25 32.6,74.08
  Bottom 0.305: C1.1 v46.43,59.26 46.41,59.28 46.41,61.24 45.76,61.89 | v42.9,63.37 C18.1 45.76,61.89 | v50.44,64.54 50.44,64.24 50.83,63.86 50.83,63.44 C19.1 51.13,63.07 51.1,63.04 46.25,63.04 45.74,62.53 45.74,61.9 45.76,61.89 | J3.3 61.62,8.44 61.62,12.62 62.56,13.56 v64.77,13.56 64.87,13.66 64.87,15.82 65.17,16.12 C4.1 | v41.58,37.19 41.58,28.65 v42.24,27.99 | v61.29,23.93 60.71,23.93
  Bottom 0.406: v61.37,45.57 61.37,56.69 v61.39,56.72 | v60.71,33.83 60.71,23.93 60.71,23.62 61.52,22.81 68.07,22.81 69.47,21.41 69.47,14.1 v70.1,13.46 | v70.16,60.38 69.42,61.11 69.42,80.39 69.06,80.75 59.49,80.75 59.28,80.54 | 59.28,80.54 58.65,79.91 58.65,75.46 v57.91,74.73 | v55.65,81.76 58.06,81.76 59.28,80.54
  pour Top (no thermals): 60.38,57.28 66.19,57.28 66.9,56.57 69.32,56.57 69.72,56.16 69.72,55.07 70.08,54.71 71.22,54.71 71.32,54.81 71.32,58.45 72.03,59.16 72.03,62.38 71.68,62.74 61.59,62.74 60.12,61.26 60.12,57.53
+5V  (via drill 0.3, 0.5, 0.6)
  Top 0.178: U10.5 55.54,17.44 55.47,17.37 53.81,17.37 R19.1 | R21.1 59.22,17.46 59.33,17.58 60.54,17.58 U5.5 | U8.9 19.67,76.74 | 19.67,76.74 20.02,77.09 22.5,77.09 | 22.5,77.09 22.73,77.09 U8.8 | U8.12 19.64,75.24 19.84,75.44 19.84,76.25 19.84,76.58 19.67,76.74 | U11.8 59.38,75.35 59.33,75.31 59.33,74.93 v59.26,74.85 | U11.12 62.98,76.85 62.81,76.68 62.81,74.6 62.94,74.47 63.83,74.47 | v22.53,78 22.53,77.88 22.53,77.11 22.5,77.09 | 63.83,74.47 64.77,74.47 v64.9,74.6 | U11.9 63.86,74.5 63.83,74.47
  Top 0.203: U8.7 U8.8
  Top 0.254: U11.8 U11.7 | C24.1 18.83,78.64 U8.9 | C26.1 20.57,78.22 20.93,77.85 22.5,77.85 22.53,77.88 | v48.77,74.19 44.55,74.19 v44.12,74.22 | v20.42,76.1 19.99,76.1 19.84,76.25
  Top 0.305: v79.5,38.56 79.32,38.56 79.05,38.84 | 79.05,38.84 79.07,38.84 | 79.05,38.84 78,38.84 77.93,38.76 | U5.5 59.47,17.66 59.41,17.6 59.05,17.6 58.98,17.53 59.72,17.53 59.87,17.68 59.87,18.57 v59.97,18.77 | U10.5 v55.54,19.42 v55.55,19.43
  Top 0.406: C42.+ 75.06,34.9 v75.77,34.19 | v54.91,12.06 54.91,8 54.25,7.34 54.25,5.26 55.19,4.32 66.55,4.32 67.46,5.23 67.46,8.18 J3.6
  Top 0.61: R42.2 73.85,38.75 L6.2
  Bottom 0.178: 64.62,74.85 v64.9,74.6 | R23.2 20,78.2 20.07,78.13 22.4,78.13 v22.53,78
  Bottom 0.254: v59.26,74.85 59.26,74.37 58.62,73.74 49.23,73.74 v48.77,74.19 | v20.42,76.1 20.8,76.48 31.27,76.48 32.84,74.85 33.5,74.22 v44.12,74.22
  Bottom 0.305: v79.5,38.56 79.83,38.89 79.83,55.04 78.77,56.11 70.26,56.11 68.48,57.89 68.48,74.12 67.97,74.6 v64.9,74.6 64.9,74.45 64.49,74.85 v59.26,74.85 | C8.1 61.43,17.12 60.05,17.12 59.97,17.2 v59.97,18.77 59.97,17.86 59.77,17.65 58.95,17.65 58.08,17.66 C9.1 55.55,18.2 v55.55,19.43
  Bottom 0.406: 61.43,17.12 60.15,17.12 59.89,17.37 59.89,17.4 59.69,17.6 54.94,17.6 54.48,17.14 54.48,12.5 v54.91,12.06
  Bottom 0.61: v75.77,34.19 75.77,12.75 74.95,11.94 69.29,11.94 67.41,10.06 J3.6
  pour Top (no thermals): 70.23,39.34 80.19,39.34 81.25,38.28 81.25,34.67 80.44,33.86 75.82,33.86 75.29,33.32 71.78,33.32 71.17,33.93 71.17,36.35 69.75,37.77 69.75,39.14 69.93,39.32 70.21,39.32
+9V  (via drill 0.3, 0.5)
  Top 0.178: 74.42,26.24 74.42,26.16 74.14,25.88 | v57.89,29.62 64.72,29.62 v65.38,30.28
  Top 0.254: U7.2 73.97,25.45 74.35,25.83 74.35,26.16 74.42,26.24 74.42,26.07 R14.2
  Top 0.305: U17.12 v72.21,46.81 | v74.85,46.71 74.85,45.68 U17.16 | U17.5 72.24,50.44 v72.29,50.39 | v75.16,50.27 75.16,51.17 U17.1
  Top 0.406: 74.14,25.88 74.14,24.69 v74.19,24.64
  Top 0.61: L2.1 62.59,43.41 v63.07,43.89
  Bottom 0.178: R12.2 18.01,81.97 16.26,80.21 16.26,61.98 17.32,60.99 31.22,60.99 32.16,59.97 32.16,52.27 32.56,51.87 36.98,51.87 39.09,49.76 39.09,40.08 40.49,38.68 45.74,38.68 48.01,36.42 48.01,30.2 48.77,29.44 57.71,29.44 v57.89,29.62 | v65.38,30.28 74.09,30.28 74.19,30.17
  Bottom 0.305: v72.21,46.81 74.75,46.81 | 74.75,46.81 v74.85,46.71 | v72.29,50.39 75.03,50.39 v75.16,50.27 74.75,49.86 74.75,46.81
  Bottom 0.406: v74.19,24.64 74.19,30.17 74.19,34.19 72.08,36.3 63.73,36.3 62.71,37.31 62.71,43.54 v63.07,43.89
  Bottom 0.61: v63.07,43.89 73.97,43.89 74.8,44.73 74.8,46.66 v74.85,46.71
+24V  (via drill 0.3)
  Top 0.178: R10.2 2.12,45.22 2.52,45.62 6.43,45.62 K1.C+
  Top 1.676: K1.C+ 7.65,46.84 8,46.84 8.18,46.66 13.74,46.66 17.7,42.7 24.99,42.7 25.48,42.21 25.48,39.14 28.09,36.52 37.57,36.52 39.27,34.82 J5.5
  Bottom 0.178: R13.2 15.43,83.4 15.43,63.66 14.07,62.31 5.23,62.31 3.89,60.96 3.89,49.96 5.31,48.54 6.73,48.54 6.99,48.29 6.99,47.1 K1.C+
  Bottom 0.61: 1.96,34.39 2.49,34.92
  Bottom 1.422: J10.1 3.94,11.1 1.7,13.33 1.7,34.14 2.49,34.92
  other vias: 1.12,37.36 2.06,37.36 3.05,37.36 1.14,34.49 1.14,35.43 1.14,36.42 2.08,34.52 2.08,35.46 2.08,36.45 4.95,34.57 4.01,34.57 3.02,34.57
  pour Top (no thermals): 0.76,37.82 5.69,37.82 6.43,37.08 6.43,33.81 6.07,33.45 0.84,33.45 0.66,33.63 0.66,37.72
  pour Bottom (no thermals): 0.58,38 5.66,38 6.2,38.53 6.2,48.26 6.63,48.69 9.22,48.69 9.65,48.26 9.65,34.9 7.87,33.12 0.74,33.12 0.46,33.4 0.46,37.87
BMS-SET  (via drill 0.3)
  Top 0.178: U6.24 43.5,55.8 42.85,55.14 34.72,55.14 33.6,56.26 33.6,60.17 33.33,60.45 v12.45,60.45
  Bottom 0.178: U23.5 10.89,55.99 10.62,56.26 9.35,56.26 8.89,55.8 8.89,54.69 8.61,54.41 6.3,54.41 5.87,54.84 5.87,59.51 6.78,60.43 10.77,60.43 | 10.77,60.43 11.89,60.43 11.91,60.45 v12.45,60.45 | R36.2 10.78,60.41 10.77,60.43
BMS-SS  (via drill 0.3)
  Top 0.178: U6.23 42.7,55.94 42.42,55.65 35.05,55.65 34.19,56.51 34.19,60.58 33.43,61.32 v10.9,61.32
  Bottom 0.178: U23.2 R35.2 10.63,49.58 6.48,49.58 5.36,50.7 5.36,59.77 6.55,60.96 10.54,60.96 v10.9,61.32
CS
  Top 0.178: J3.1 57.41,10.76 56.49,11.68 56.49,13.51 | 56.49,13.51 U10.2 | R19.2 53.8,14.17 54.25,13.72 56.29,13.72 56.49,13.51
CS1  (via drill 0.3)
  Top 0.178: U11.5 58.36,76.85 57.56,76.05 J12.2 56.11,76.04 v56.11,70.05 | U6.34 52.13,59.07 52.12,59.05 52.12,57.73 v52.45,57.4
  Bottom 0.178: v52.45,57.4 52.45,59.59 53.37,60.5 53.37,64.85 53.75,65.23 56.92,65.23 57.94,66.24 57.94,67.54 57.23,68.25 56.41,68.25 56.11,68.55 v56.11,70.05
CS2  (via drill 0.3)
  Top 0.178: v50.11,54.61 50.06,54.61 49.91,54.76 49.91,57.26 U6.32 | U8.5 24.22,75.24 24.69,74.78 29.77,74.78 30.12,74.32 30.12,70.97 29.84,70.69 28.11,70.69 J13.1
  Bottom 0.178: v50.11,54.61 49.86,54.36 39.19,54.36 38.68,54.86 38.68,60.35 35.48,63.55 30.33,63.55 29.72,64.16 29.72,69.52 29.21,70.03 28.61,70.03 J13.1
CS_OUT  (1 unrouted)
  Top 0.254: R15.1 62.76,26.34 62.53,26.11 62.53,26.21
EN1  (via drill 0.3)
  Top 0.178: U11.1 56.87,78.85 J12.1 56.07,78.82 54.51,78.82 54,78.31 54,74.07 55.12,72.95 55.12,69.62 55.52,69.21 v57.28,69.21 | 52.09,59.84 52.12,59.87 U6.35 53.82,59.87 54.05,59.66 v54.05,58.24
  Bottom 0.178: v54.05,58.24 54.03,59.89 54.03,64.44 54.3,64.72 57.2,64.72 58.47,65.99 58.47,67.87 57.28,69.06 v57.28,69.21
EN2  (via drill 0.3)  (1 unrouted)
  Top 0.178: 50.83,56.97 50.83,56.01 v51.16,55.68 | U8.1 27.93,73.24 J13.2
  Bottom 0.178: v51.16,55.68 49.58,55.68 48.87,54.97 39.7,54.97 39.32,55.35 39.32,60.55 35.84,64.03 30.99,64.03 30.43,64.59 30.43,73.02 30.1,73.35 28.08,73.35 J13.2
GND  (via drill 0.3, 0.5)  (2 unrouted)
  Top 0.178: U8.14 17.91,74.24 17.88,74.27 19.71,74.27 19.71,74.68 | 19.79,74.62 19.71,74.68 | 19.71,74.68 17.88,74.68 | U11.14 62.86,77.85 62.84,77.88 64.77,77.88 64.82,77.83 | U3.5 41.79,78.82 42.27,79.3 42.82,79.3 42.88,79.35 42.88,80.18 C16.2
  Top 0.305: U17.4 72.89,52.29 | 72.89,52.29 72.92,52.32 72.92,51.36 72.85,51.28 72.85,51.71 | U17.8 70.29,52.33 70.31,52.35 | U17.13 72.86,46.19 73.15,46.56 | 72.89,52.29 72.7,52.29 v72.06,52.93 | U3.5 39.9,78.82 39.85,78.87 39.88,78.87 | U3.13 34.83,78.19 34.72,78.08
  Top 0.406: U3.13 36.54,78.19 36.68,78.05
  Top 0.508: 73.15,46.56 73.15,47.78 v73.28,47.9
  other vias: 20.07,74.47 55.02,63.88 56.9,51.77 52.68,47.85 1.63,61.85 37.49,78.08 41.83,75.13 71.86,49.15 73.28,49.12 71.83,47.9 36.17,81.89 65.35,78.97 67.94,76.45 27.56,77.9 20.42,66.32 27.43,66.75 24.31,74.04 30.96,74.04
  pour Top (isolate 0.305, rank 5): 0,0 83.82,0 83.69,62.84 70.03,62.84 70.16,91.44 12.7,91.44 12.73,63.27 0.03,63.27
  pour Bottom (isolate 0.305, rank 4): 83.82,0 0,0 0,63.27 12.7,63.27 12.7,91.44 70.16,91.44 70.08,62.84 83.74,62.84
HV-SENSE  (via drill 0.3)
  Top 0.178: J3.2 59.41,10.95 61.57,13.11 61.57,13.51 | 61.57,13.51 U5.2 | R21.2 59.07,13.98 59.54,13.51 61.57,13.51 | U6.12 37.96,67.07 37.21,66.32 37.21,63.88 36.55,63.22 23.62,63.22 v23.16,63.68 | v44.88,39.73 44.88,38.18 46.97,36.09 v46.97,34.75 46.97,34.54
  Bottom 0.178: v23.16,63.68 23.16,63.27 24.94,61.49 31.45,61.49 32.72,60.22 32.72,52.78 33.07,52.43 37.26,52.43 39.75,49.94 39.75,40.31 40.77,39.29 44.45,39.29 v44.88,39.73 | J3.2 59.41,10.31 58.83,10.9 54.18,10.9 53.34,11.73 53.34,26.9 52.17,28.07 47.78,28.07 46.99,28.85 46.99,34.72 v46.97,34.75
IMD  (via drill 0.5)
  Top 0.178: R24.2 13.84,82.45 v14.25,82.04 | v2.69,55.68 4.47,55.68 5.46,54.69 18.41,54.69 20.57,52.53 20.57,45.44 v21.51,44.5 | v24.18,29.84 11.18,29.84 9.5,28.17 9.5,8.66 9.2,8.36 5.44,8.36 J10.2
  Top 0.305: J5.10 56.79,28.55 55.83,29.51 24.51,29.51 v24.18,29.84
  Bottom 0.178: v14.25,82.04 14.25,63.55 13.74,63.04 4.75,63.04 3.23,61.52 3.23,56.21 v2.69,55.68 | v21.51,44.5 21.51,41.25 24.05,38.71 24.05,29.97 v24.18,29.84
  Bottom 0.61: R34.2 5.47,8.32 J10.2
INTERLOCK_IN
  Bottom 2.54: J5.11 50.95,20.75 48.39,18.19 48.39,8.61 46.76,6.98 42.58,6.98 J8.2
INTERLOCK_OUT
  Bottom 2.54: J5.12 45.11,20.24 42.52,17.65 42.52,11.11 J8.1
MISO  (via drill 0.3)
  Top 0.178: U11.3 60.83,77.85 61.37,77.32 61.37,73.25 61.77,72.85 61.77,69.76 J11.2 61.77,69.75 R29.1 | U6.37 55.63,61.47 v55.83,61.26 | U8.3 21.51,74.24 | 21.51,74.24 | 21.51,74.24 v21.34,74.07
  Bottom 0.178: J11.2 61.87,69.65 61.87,63.4 61.34,62.86 56.19,62.86 55.83,62.51 v55.83,61.26 56.01,61.09 56.01,53.62 55.65,53.26 38.76,53.26 37.69,54.33 37.69,59.84 35.03,62.51 25.6,62.51 25.25,62.86 25.25,71.4 24.71,71.93 21.69,71.93 21.34,72.29 v21.34,74.07
MOSI  (via drill 0.3)
  Top 0.178: U11.2 61.15,78.35 61.98,77.52 61.98,74.27 62.59,73.66 64.01,73.66 64.41,73.25 64.41,70.12 J11.3 64.21,69.92 R30.1 | U6.38 56.6,62.27 v56.9,61.98 | U8.2 22.26,73.74 22.05,73.53 22.05,72.47 22.23,72.29 23.82,72.29 24.36,71.75 v24.36,71.04
  Bottom 0.178: J11.3 64.19,69.89 64.19,62.15 64.01,61.98 v56.9,61.98 57.07,61.8 57.07,53.62 56.19,52.73 38.58,52.73 37.16,54.15 37.16,59.66 34.85,61.98 25.25,61.98 24.36,62.86 v24.36,71.04
N$1
  Top 0.178: D12.A 24,82.58 R25.2
N$2
  Top 0.178: U6.31 49.1,52.55 49.43,52.22 50.43,52.22 Y1.3 50.65,52.25 51.03,51.87 53.01,51.87 C21.1
N$3
  Top 0.305: R6.1 47.45,37.85 46.94,38.35 D13.A
N$4
  Top 0.178: U6.30 48.3,50.21 48.01,49.91 46.79,49.91 Y1.1 44.43,49.95 C3.1
N$5
  Top 0.254: U9.1 35.78,66.36 SJ3.1
N$6  (via drill 0.3)
  Top 0.178: D7.A 28.02,90.25 v28.04,90.58
  Bottom 0.178: v28.04,90.58 28.04,88.65 R8.1
N$7  (via drill 0.3)
  Top 0.178: v18.01,86.39 D9.A
  Bottom 0.178: R12.1 v18,86.38 v18.01,86.39
N$8
  Top 0.178: D7.C 28.02,86.4 28.55,85.88 32.87,85.88 34.14,87.15 40.51,87.15 41.6,86.05 41.6,81.64 41.91,81.33 41.91,80.34 41.66,80.09 U3.7
N$9  (via drill 0.3)
  Top 0.178: v19.99,86.36 19.99,87.74 D10.A
  Bottom 0.178: R23.1 v20,86.35 v19.99,86.36
N$10
  Top 0.178: D1.C 25.92,85.76 26.59,85.09 31.27,85.09 31.62,84.73 31.62,78.61 32.69,77.55 35.67,77.55 U3.14
N$11  (via drill 0.3)
  Top 0.305: Q1.1 1.45,40.44 v1.27,40.26 2.12,41.11 R10.1
  Bottom 0.305: v1.27,40.26 2.16,41.15 2.16,42.45 R10.1 2.17,42.53 R28.2
N$12
  Top 0.178: R27.1 14.18,32.46 D15.A
N$13  (via drill 0.3)
  Top 0.178: v22,86.36 D11.A
  Bottom 0.178: R26.1 v22,86.36
N$14
  Top 0.178: U4.3 39.45,74.47 39.12,74.8 39.12,77.85 39.52,78.26 40.89,78.26 U3.4
N$15
  Top 0.178: U4.2 42.47,73.78 42.65,73.96 42.65,76.02 42.44,76.23 41.02,76.23 U3.1
N$16
  Top 0.178: U3.9 37.73,80.73 38.3,81.31 38.3,83.6 J14.2
N$17
  Bottom 0.61: K1.-8-S 8.01,57.35 11.56,57.35 11.84,57.07 U23.6
N$18
  Top 0.178: U3.8 40.3,80.73 39.93,81.1 39.93,85.37 39.52,85.78 38.47,85.78 J14.3
N$19
  Top 0.254: R11.1 61.89,21.22 62.64,20.47 62.64,17.65 62.66,17.63 62.66,17.53 62.61,17.47 62.61,17.75 | 62.61,17.86 62.61,17.75 | 62.61,17.75 U5.4
N$20  (via drill 0.3)
  Top 0.178: v26.31,90.58 26.31,89.41 D1.A
  Bottom 0.178: R7.1 26.16,90.42 v26.31,90.58
N$22
  Top 0.305: R9.1 48.88,42.06 D14.A
N$23
  Top 0.178: U1.7 54.25,34.94 R2.1 54.75,32.88 55.78,31.85 56.74,31.85 J5.2
N$24
  Top 0.178: U1.6 53.6,35.09 R2.2 52.95,32.55 52.32,31.93 50.98,31.93 J5.3
N$25
  Top 0.178: U8.16 18.83,71.94 R53.1
N$26
  Top 0.178: U8.15 19.63,73.74 20.12,73.25 20.12,71.63 20.32,71.42 20.7,71.42 R53.2 20.91,71.64 R54.2
N$27  (via drill 0.3)
  Top 0.254: U6.7 45.9,67.03 v45.92,67
  Bottom 0.254: v45.92,67 45.92,67.18 45.74,67.36 C12.A
N$28
  Top 0.178: U11.16 63.64,78.85 63.63,78.87 63.63,80.31 R55.1
N$29
  Top 0.178: U11.15 63,78.35 62.71,78.64 62.71,79.17 62.53,79.35 61.75,79.35 61.65,79.45 61.65,80.49 R55.2 R56.2
N$30  (via drill 0.3)
  Top 0.178: v16,86.36 15.72,88.1 D2.A
  Bottom 0.178: R13.1 v16,86.36
N$31
  pour Bottom: 31.7,29.79 31.7,41.58 30.71,42.57 30.71,48.23 31.83,49.35 35.46,49.35 36.25,48.56 36.25,30.28 35.23,29.26 32.23,29.26
N$32
  pour Bottom: 25.22,32.23 25.22,58.67 26.24,59.69 29.49,59.69 30.1,59.08 30.1,41.76 30.96,40.89 30.96,30.89 29.44,29.36 25.63,29.36 25.2,29.79 25.2,32.21
N$33  (via drill 0.6)
  Top 0.406: v4.95,73.35 6.69,73.35 TX3.6
  Bottom 0.406: J1.2 4.38,73.93 v4.95,73.35
N$34
  Top 0.406: TX3.4 2.98,78.55 2.36,79.17 2.36,83.5 J1.1
N$35
  Top 0.178: U8.11 18.14,75.74 17.27,75.08 16.54,75.08 R17.1
  Top 0.406: TX3.1 14.87,73.47 R17.1
N$36
  Top 0.178: U8.10 18.14,76.24 17.27,76.91 R17.2
  Top 0.406: TX3.3 14.87,78.55 R17.2
N$37
  Top 0.254: U11.11 64.47,76.35 65.63,76.91 R1.1
  Top 0.406: TX4.1 68.17,78.55 R1.1
N$38
  Top 0.254: U11.10 64.46,75.85 65.63,75.08 66.5,75.08 R1.2
  Top 0.406: TX4.3 68.17,73.47 R1.2
N$39
  Top 0.254: U7.3 72.43,26.4 72.64,26.62 72.64,27.84 | 72.64,27.84 72.64,27.98 R5.2 | R14.1 72.76,27.72 72.64,27.84
N$40
  Top 0.254: R5.1 70.83,24.8 70.54,24.51 69.55,24.51 U7.6
N$41  (via drill 0.3)
  Top 0.178: U10.4 57.44,20.25 v57.45,20.27 | v57.45,22.4 69.81,22.4 R22.1
  Bottom 0.178: v57.45,20.27 v57.45,22.4
N$42
  Top 0.178: D3.A 13.82,85.23 R24.1
N$43
  Top 0.254: SJ2.2 34.24,76.25 34.47,76.3 35.66,76.3 U3.16
N$44  (via drill 0.3)
  Top 0.178: R25.1 25.44,80.76 25.76,80.44 25.76,79.02 v25.83,78.94 | v17.37,62.48 33.1,62.48 34.95,60.63 34.95,59.51 35.41,59.05 40.89,59.05 U6.22
  Bottom 0.178: v25.83,78.94 25.65,78.94 23.67,76.96 17.68,76.96 17.3,76.58 17.3,62.56 v17.37,62.48
N$45  (via drill 0.3, 0.6)
  Top 0.178: S2.2 60.14,89.32 59.72,88.9 59.72,85.75 59.23,85.27 53.21,85.27 v52.35,86.13
  Top 0.254: JP1.5 47.42,86.56 47.69,86.29 R3.1 46.08,85.95 45.82,85.7 45.82,84.96 v46.25,84.53 | SJ3.2 35.84,68.61 v36.12,68.88
  Bottom 0.178: C2.1 35.87,66.97 R16.1 | v52.35,86.13 47.85,86.13 47.42,86.56 JP1.5 | v46.25,84.53 46.25,82.6 45.62,81.97 45.62,72.26 45.49,72.14 43.51,72.14 42.75,71.37 42.75,70.36 42.55,70.15 39.37,70.15 38.18,68.96 36.2,68.96 v36.12,68.88
  Bottom 0.254: v36.12,68.88 36.12,67.22 R16.1
N$46  (via drill 0.3)
  Top 0.178: U6.18 39.23,62.27 v39.04,62.46
  Bottom 0.178: v39.04,62.46 38.2,62.46 36.2,64.46 36.2,64.89 R16.2
N$47  (via drill 0.3)
  Top 0.178: U6.8 45.1,70.4 v45.39,70.69
  Bottom 0.178: v45.39,70.69 46.28,70.69 47.04,71.45 47.04,81.46 49.23,83.64 53.7,83.64 55.09,85.04 55.09,89.15 JP1.2
N$48  (via drill 0.3)
  Top 0.178: U6.9 44.3,70.43 v44.04,70.69 | v53.77,86.46 57.33,86.46 57.61,86.74 57.61,88.93 JP1.1
  Bottom 0.178: v44.04,70.69 44.04,71.07 44.55,71.58 46.02,71.58 46.38,71.93 46.38,81.74 48.9,84.25 52.68,84.25 53.8,85.37 53.8,86.44 v53.77,86.46
N$49
  Top 0.254: U7.4 67.66,26.4 R15.2
N$50  (via drill 0.3)
  Top 0.305: Q3.3 3.68,47.81 v3.86,47.62
  Bottom 0.305: v3.86,47.62 2.41,47.62 2.16,47.37 2.16,44.36 R28.1
N$51
  Top 0.178: R27.2 10.24,35.57 10.52,35.84
  pour Top (no thermals): 6.86,34.7 6.86,40.97 7.72,41.83 16.13,41.83 17.3,40.67 17.3,34.87 16.46,34.04 7.82,34.04
N$53
  Top 0.406: J2.2 81.21,79.26 80.42,78.46 76.32,78.46 TX4.6
N$54
  Bottom 0.61: K1.-9-R 9.53,51.71 9.93,52.12 9.93,52.69 U23.3
N$55  (via drill 0.6)
  Top 0.406: v78.51,73.51 76.27,73.51 TX4.4
  Bottom 0.406: J2.1 79.21,74.21 v78.51,73.51
N$69
  Top 0.178: U4.7 35.48,73.78 R4.1
N$77
  Top 0.178: U17.11 71.56,43.74 C44.1
N$85  (via drill 0.6)
  Top 0.406: U3.12 34.48,78.82 v34.04,79.27
  Bottom 0.406: v34.04,79.27 33.83,79.27 33.43,79.68 33.43,81.23 C20.1
  Bottom 0.813: J14.1 33.36,83.68 C14.A 33.31,81.35 C20.1
N$88
  Top 1.016: 43.79,34.34 L3.2
  Top 1.676: J5.4 45.11,33.63 44.4,34.34 43.79,34.34
N$89
  Top 0.61: J5.1 62.64,34.6 D4.A
N$91
  Top 0.61: L2.2 62.59,39.01 D4.C
N$94
  Top 0.305: U17.2 74.19,52.25 74.42,52.48 75.13,52.48 75.29,52.63 75.29,53.48 C36.1
N$97
  Top 0.508: U17.3 73.54,53.46 C36.2 73.57,56.27 L5.2
N$98
  Top 0.406: U17.15 74.16,44.76 74.37,44.55 75.11,44.55 75.34,44.32 75.34,43.45 C37.1
N$99
  Top 0.457: U17.14 73.51,43.54
  Top 0.508: 73.51,43.54 C37.2 73.62,42 L6.1
N$100
  Top 0.305: 70.31,45.26 70.29,45.28 U17.9 68.55,45.64 C38.1
N$101
  Top 0.305: R39.1 68.3,53.5 R40.2 68.41,53.44 70.69,53.44 70.94,53.19 U17.7
N$102
  Top 0.305: U17.6 71.59,50.61 70.99,50.01 70.18,50.01 69.39,49.22 68.47,49.22 C41.1
N$103
  Top 0.178: R42.1 67.83,42.24 | 67.83,42.24 67.83,42.37 | 67.83,42.37 67.83,42.81 67.74,42.9 67.74,42.7 67.87,42.57 | U17.10 70.91,44.78 70.56,44.42 68.02,44.42 67.79,44.2 67.79,42.28 67.83,42.24 | R41.2 67.83,42.37
PRE_CRG-B_AIR
  Bottom 2.54: J9.1 J7.1 23.25,11.28 25.81,11.28 27.39,12.87 27.39,25.72 J5.15
RE
  Top 0.178: U6.43 54.91,66.27 57.78,63.4 57.78,46.38 57.15,45.75 54.15,45.75 53.92,45.52 53.92,43.88 RE.2
  Top 0.305: RE.1 53.9,40.65 | 53.9,40.65 U1.2 | U1.3 53.6,40.35 53.9,40.65
  Top 0.508: RE.2 RE.1
RX2  (via drill 0.3)
  Top 0.178: U6.5 47.5,66.04 v47.83,65.71 | v56.19,66.24 56.19,65.84 58.32,63.75 58.32,39.57 57.99,39.24 55.14,39.24 54.89,39.5 U1.1 | D14.C 50.16,44.18 v50.22,44.12 | v57.33,43.99 56.27,43.99 RX.2
  Top 0.305: U1.1 55.66,40.29 56.16,40.79 56.16,42.08 RX.1
  Top 0.508: RX.2 RX.1
  Bottom 0.178: v47.83,65.71 49.07,65.71 49.78,66.42 56.01,66.42 v56.19,66.24 | v50.22,44.12 57.2,44.12 v57.33,43.99
SCK  (via drill 0.3)
  Top 0.178: U11.4 60.52,77.35 60.76,77.11 60.76,74.68 59.33,73.25 59.33,70.12 J11.1 59.33,69.9 R31.1 | 52.98,60.55 52.87,60.67 U6.36 54.65,60.67 v54.94,60.38 | U8.4 22.26,74.74 v21.51,75.49
  Bottom 0.178: J11.1 59.38,69.85 59.38,63.93 58.85,63.4 55.83,63.4 54.76,62.33 54.76,60.55 v54.94,60.38 54.94,54.33 54.41,53.8 38.94,53.8 38.23,54.51 38.23,60.02 35.2,63.04 26.31,63.04 25.78,63.58 25.78,71.58 24.89,72.47 22.58,72.47 22.23,72.82 22.23,74.78 v21.51,75.49
SCL  (via drill 0.3)
  Top 0.178: U12.1 66.83,17.91 67.77,17.91 67.79,17.93 v67.79,18.41 | J3.5 65.41,8.16 65.33,8.08
  Top 0.254: v52.76,68.3 52.76,67.28 52.7,67.23 52.7,67.08 52.65,67.03 52.54,67.03 U6.44
  Bottom 0.178: 59.74,34.59 59.74,21.69 60.05,21.39 67.16,21.39 67.79,20.75 v67.79,18.41 67.79,17.96 68.07,17.42 68.07,12.73 67.79,12.45 66.04,12.45 65.41,11.82 J3.5 65.18,7.99 R32.2
  Bottom 0.254: 59.74,34.59 59.74,58.04 60.45,58.75 64.9,58.75 66.85,60.71 66.85,71.58 65.51,72.92 55.98,72.92 53.31,70.26 53.31,68.86 v52.76,68.3
SDA  (via drill 0.3)
  Top 0.178: J3.4 63.41,11.7 63.68,11.96 63.68,17.86 | 63.68,17.86 U12.3 | v63.68,17.93 63.68,17.86
  Top 0.254: v54.61,68.27 54.61,69.37 54.13,69.85 51.51,69.85 50.9,69.24 50.88,69.24 50.62,68.99 50.62,68.95 U6.1
  Bottom 0.178: 59.05,34.19 59.05,21.34 59.72,20.68 63.25,20.68 63.73,20.19 63.73,18.14 v63.68,17.93 | R33.2 62.88,6.26 63.12,6.5 63.12,7.93 J3.4
  Bottom 0.254: 59.05,34.19 59.05,58.34 60.17,59.46 64.62,59.46 66.04,60.88 66.04,71.4 65.13,72.31 56.59,72.31 54.84,70.56 54.84,68.5 v54.61,68.27
TOP_AIR
  Bottom 2.54: J6.1 33.43,12.18 J5.14
TSAL
  pour Top (no thermals): 19.43,41.43 22.99,41.43 23.47,40.94 23.47,31.11 22.83,30.48 19.76,30.48 19.41,30.84 19.41,41.4
TSAL_EN  (via drill 0.6)  (1 unrouted)
  Top 0.254: R11.2 19.14,21.22 v17.2,23.16 | v17.78,49.5 3.79,49.5 3.17,50.11 | R20.2 3.11,49.97 Q3.1
  Bottom 0.254: v17.2,23.16 17.2,48.92 v17.78,49.5
TSAL_EN1
  Top 0.254: U7.1 72.14,22.93 R22.2 73.56,22.61 73.58,22.58 73.93,22.58 R18.2
TX2  (via drill 0.3)
  Top 0.178: U6.4 48.3,67.37 v48.72,66.95 | v57.02,67.18 57.02,65.89 58.85,64.08 58.85,39.27 58.24,38.66 53.44,38.66 52.93,39.17 52.93,40.29 U1.4 | D13.C 46.94,45.69 47.3,46.05 51.54,46.05 51.87,45.72 51.87,43.93 TX.2
  Top 0.305: 51.84,43.08 TX.1 51.84,40.77 52.3,40.31 U1.4 | 51.84,43.08 TX.2 | 51.79,43.13 51.84,43.08
  Bottom 0.178: v48.72,66.95 56.62,66.95 v57.02,67.18
USB_RX
  Top 0.178: U6.2 49.9,71.18 48.67,72.42 38.96,72.42 38.81,72.57 38.81,74.42 38.18,75.06 36.98,75.06 U4.5
USB_TX
  Top 0.178: U6.3 49.1,71.19 48.46,71.83 38.76,71.83 38.28,72.31 38.28,74.24 38.1,74.42 36.96,74.42 U4.6
VSS  (via drill 0.5)  (1 unrouted)
  Top 0.178: D3.C 13.82,90.3 v13.95,90.42 | v13.21,64.67 13.21,63.22 12.78,62.79 8.15,62.79 7.82,62.46 7.82,59.99 8.79,59.03 12.68,59.03 13.61,58.09 13.61,57.05 13.74,56.92
  Bottom 0.178: R34.1 7.1,6.52 6.6,6.02 | v13.95,90.42 13.21,90.42 13.06,90.27 13.06,64.82 v13.21,64.67
  Bottom 0.61: R34.1 8.2,6.5 | U23.4 9.94,54.24 10.21,53.97 11.91,53.97 | 11.91,53.97 13.79,53.97 | 13.79,53.97 13.87,53.97 13.97,53.87 | 11.91,53.97 11.84,53.9 U23.1 12.04,52.5 12.04,51.49 12.69,50.84 R35.1 | R36.1 13.72,58.83 13.97,58.57 13.97,54.15 13.79,53.97
  Bottom 1.016: 13.97,53.87 14.02,53.82 18.75,53.82 19.89,52.68 19.89,48.39 18.72,47.22 18.72,30.15 20.42,28.45 38.68,28.45 39.08,28.05 39.08,26.1 J5.13
  Bottom 2.54: 32.42,7.01 36.17,7.01 37.59,8.43 37.59,19.61 39.27,21.28 J5.13 | 32.42,7.01 J6.2 | 32.42,7.01 23.13,7.01 | 22.55,7.01 23.13,7.01 | 23.13,7.01 J7.2 J9.2 12.33,6.02 6.6,6.02 J10.3
WDI
  Top 0.178: U6.10 43.5,69.96 43.08,70.38 32.36,70.38 31.29,69.32 31.29,68.34 U9.4

### Text on the board
tPlace: HV | HV | LV | ISO | TOP | BOTTOM | PRECHARGE | INTERLOCK | BMM-BATTERY Managment Master
tNames: RJ